# Altium project IceZUM_Core_HX1K.PrjPcb (part 1 of 2)
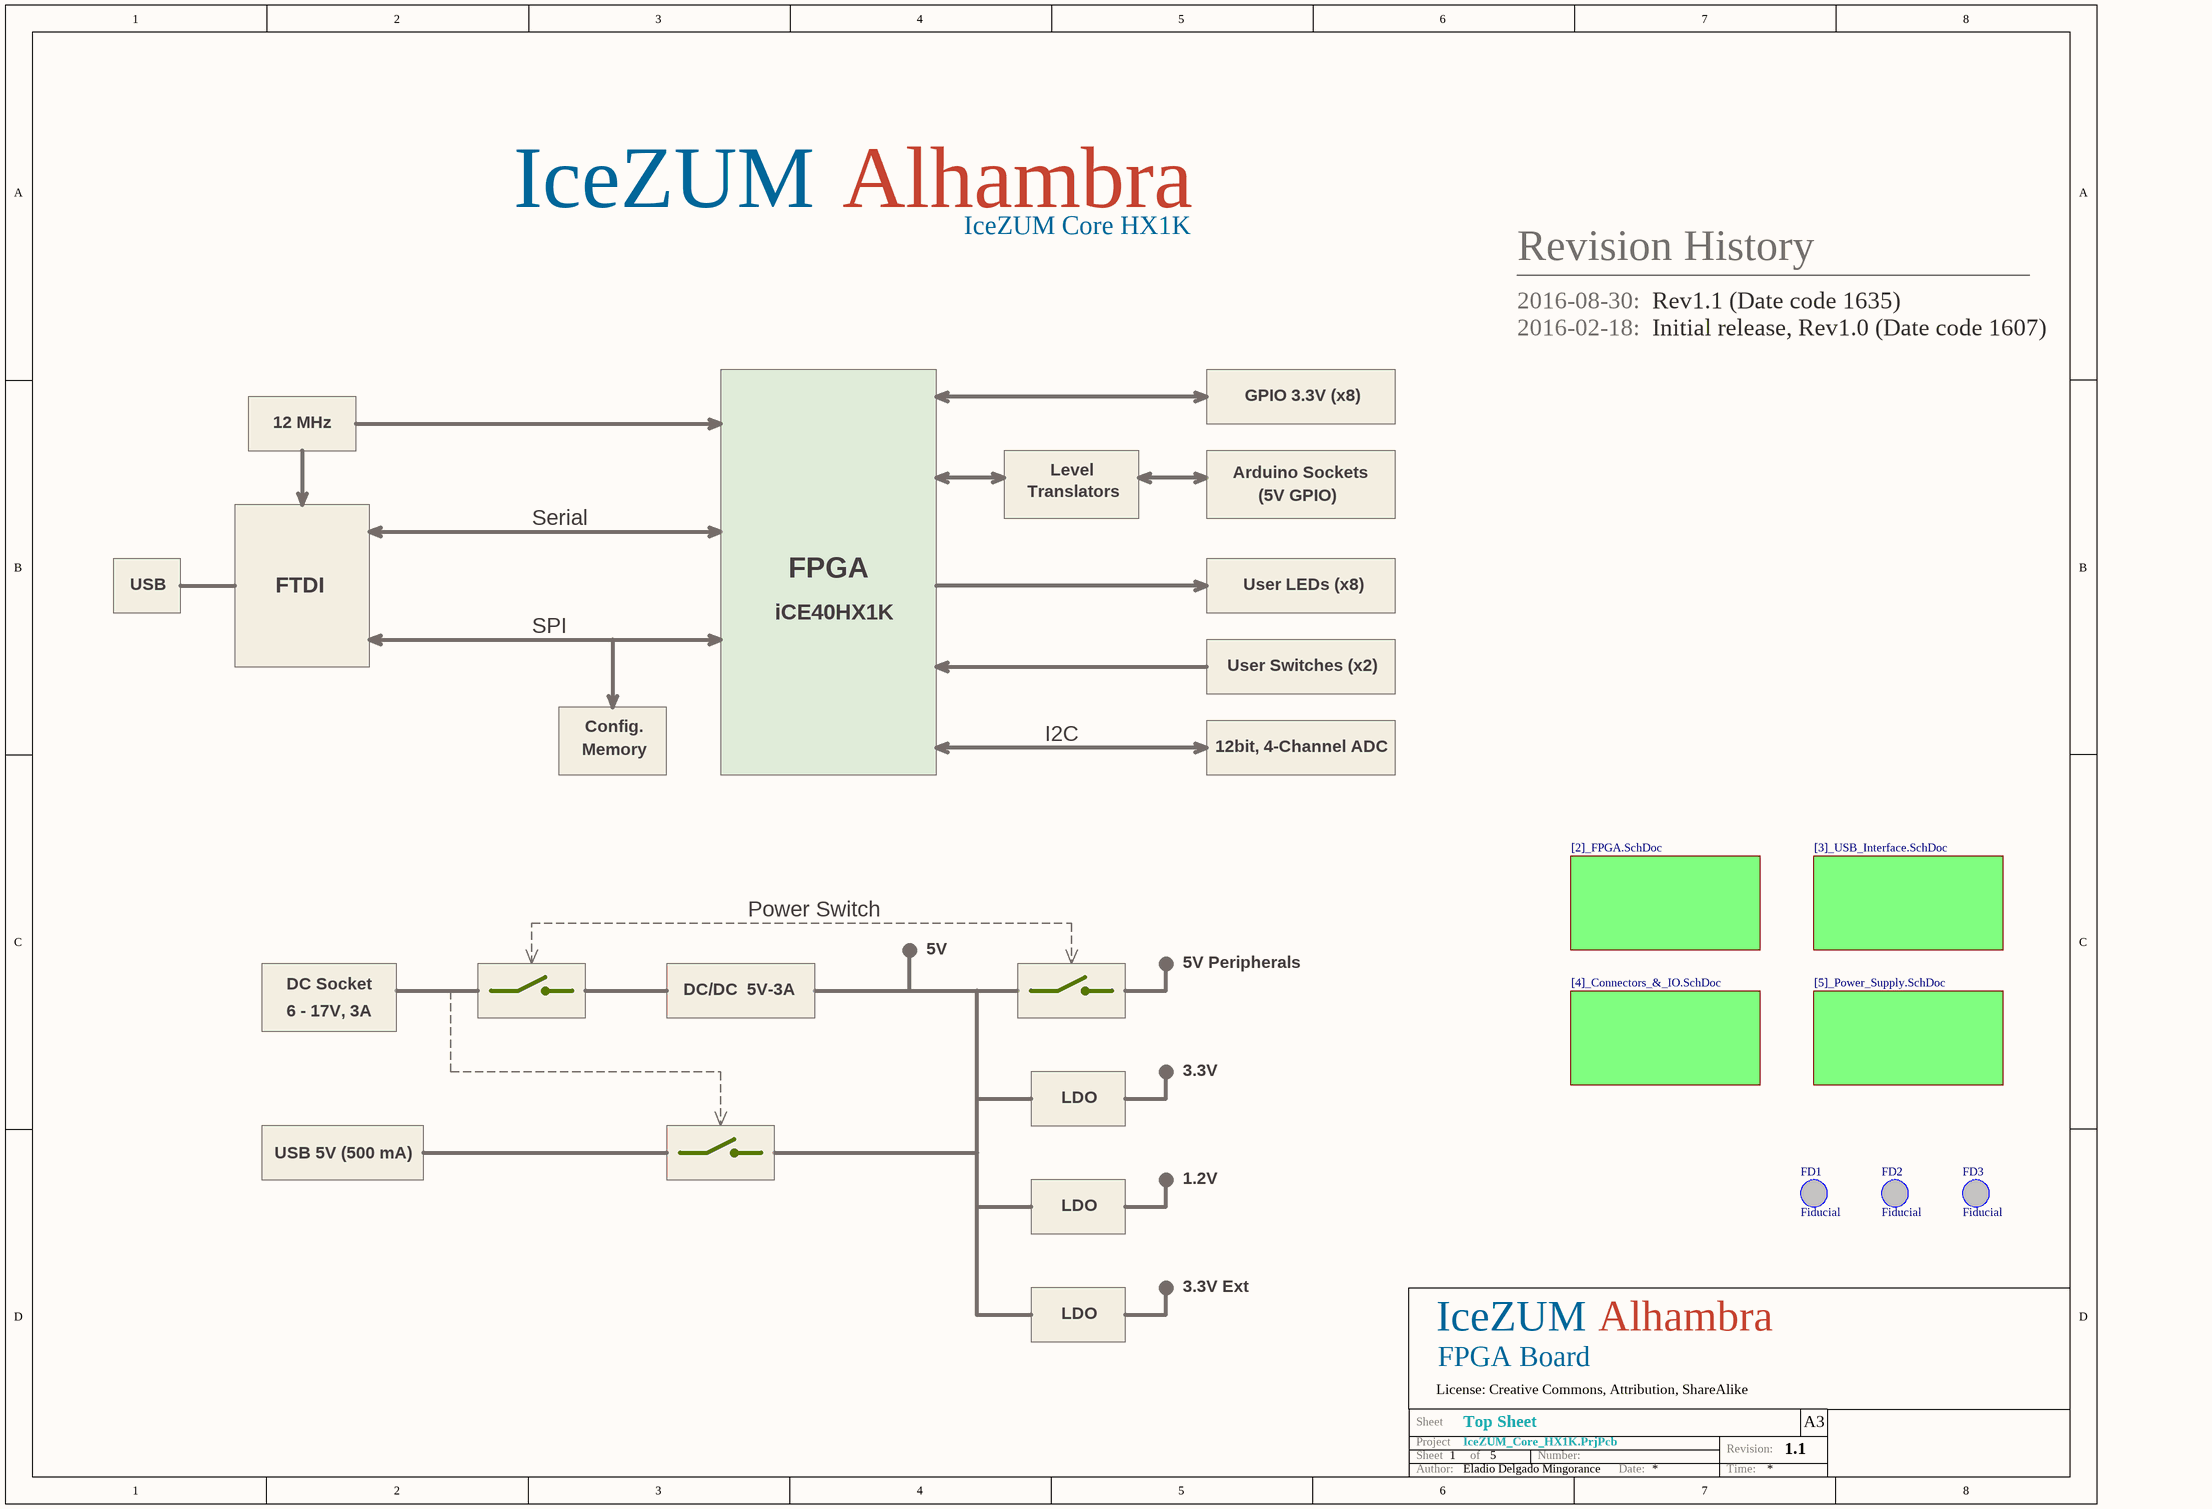
[diagram p0: [1]_IceZUM_Core_HX1K.SchDoc]
5 sheets, 189 parts. Net scope: flat (ports and power ports of the same name join across sheets).
Board file: IceZUM_Core_HX1K.PcbDoc
Sheets:
  [1]_IceZUM_Core_HX1K.SchDoc
    [2]_FPGA.SchDoc = [2]_FPGA.SchDoc
    [3]_USB_Interface.SchDoc = [3]_USB_Interface.SchDoc
    [4]_Connectors_&_IO.SchDoc = [4]_Connectors_&_IO.SchDoc
    [5]_Power_Supply.SchDoc = [5]_Power_Supply.SchDoc

## Sheet [1]_IceZUM_Core_HX1K.SchDoc: Top Sheet
size A3; Author: Eladio Delgado Mingorance; CompanyName: Mareldem Technologies; Organization: Mareldem Technologies; Revision: 1.1; SheetNumber: 1; SheetTotal: 5

### Parts
FD1  Fiducial  [Fiducial]  (no BOM)
FD2  Fiducial  [Fiducial]  (no BOM)
FD3  Fiducial  [Fiducial]  (no BOM)

### Sub-sheets
[2]_FPGA.SchDoc = [2]_FPGA.SchDoc: no entries
[3]_USB_Interface.SchDoc = [3]_USB_Interface.SchDoc: no entries
[4]_Connectors_&_IO.SchDoc = [4]_Connectors_&_IO.SchDoc: no entries
[5]_Power_Supply.SchDoc = [5]_Power_Supply.SchDoc: no entries

### Notes on the sheet
- IceZUM
- Alhambra
- IceZUM Core HX1K
- Revision History
- 2016-08-30:
- Rev1.1 (Date code 1635)
- 2016-02-18:
- Initial release, Rev1.0 (Date code 1607)
- 12 MHz
- GPIO 3.3V (x8)
- Translators
- Level
- Arduino Sockets
- (5V GPIO)
- Serial
- FPGA
- USB
- FTDI
- SPI
- iCE40HX1K
- User LEDs (x8)
- User Switches (x2)
- Memory
- Config.
- I2C
- 12bit, 4-Channel ADC
- Power Switch
- DC Socket
- 5V
- 5V Peripherals
- 6 - 17V, 3A
- DC/DC  5V-3A
- LDO
- 3.3V
- USB 5V (500 mA)
- 1.2V
- 3.3V Ext
- License: Creative Commons, Attribution, ShareAlike
- FPGA Board
- Project
- Sheet
- Sheet         of
- Number:
- Revision:
- A3
- Author:
- Date:
- Time:

### Library data of the parts
FD1-FD3 = Fiducial: Part Number: Fiducial

## Sheet [2]_FPGA.SchDoc: FPGA
size A3; Author: Eladio Delgado Mingorance; CompanyName: Mareldem Technologies; Organization: Mareldem Technologies; Revision: 1.1; SheetNumber: 2; SheetTotal: 5
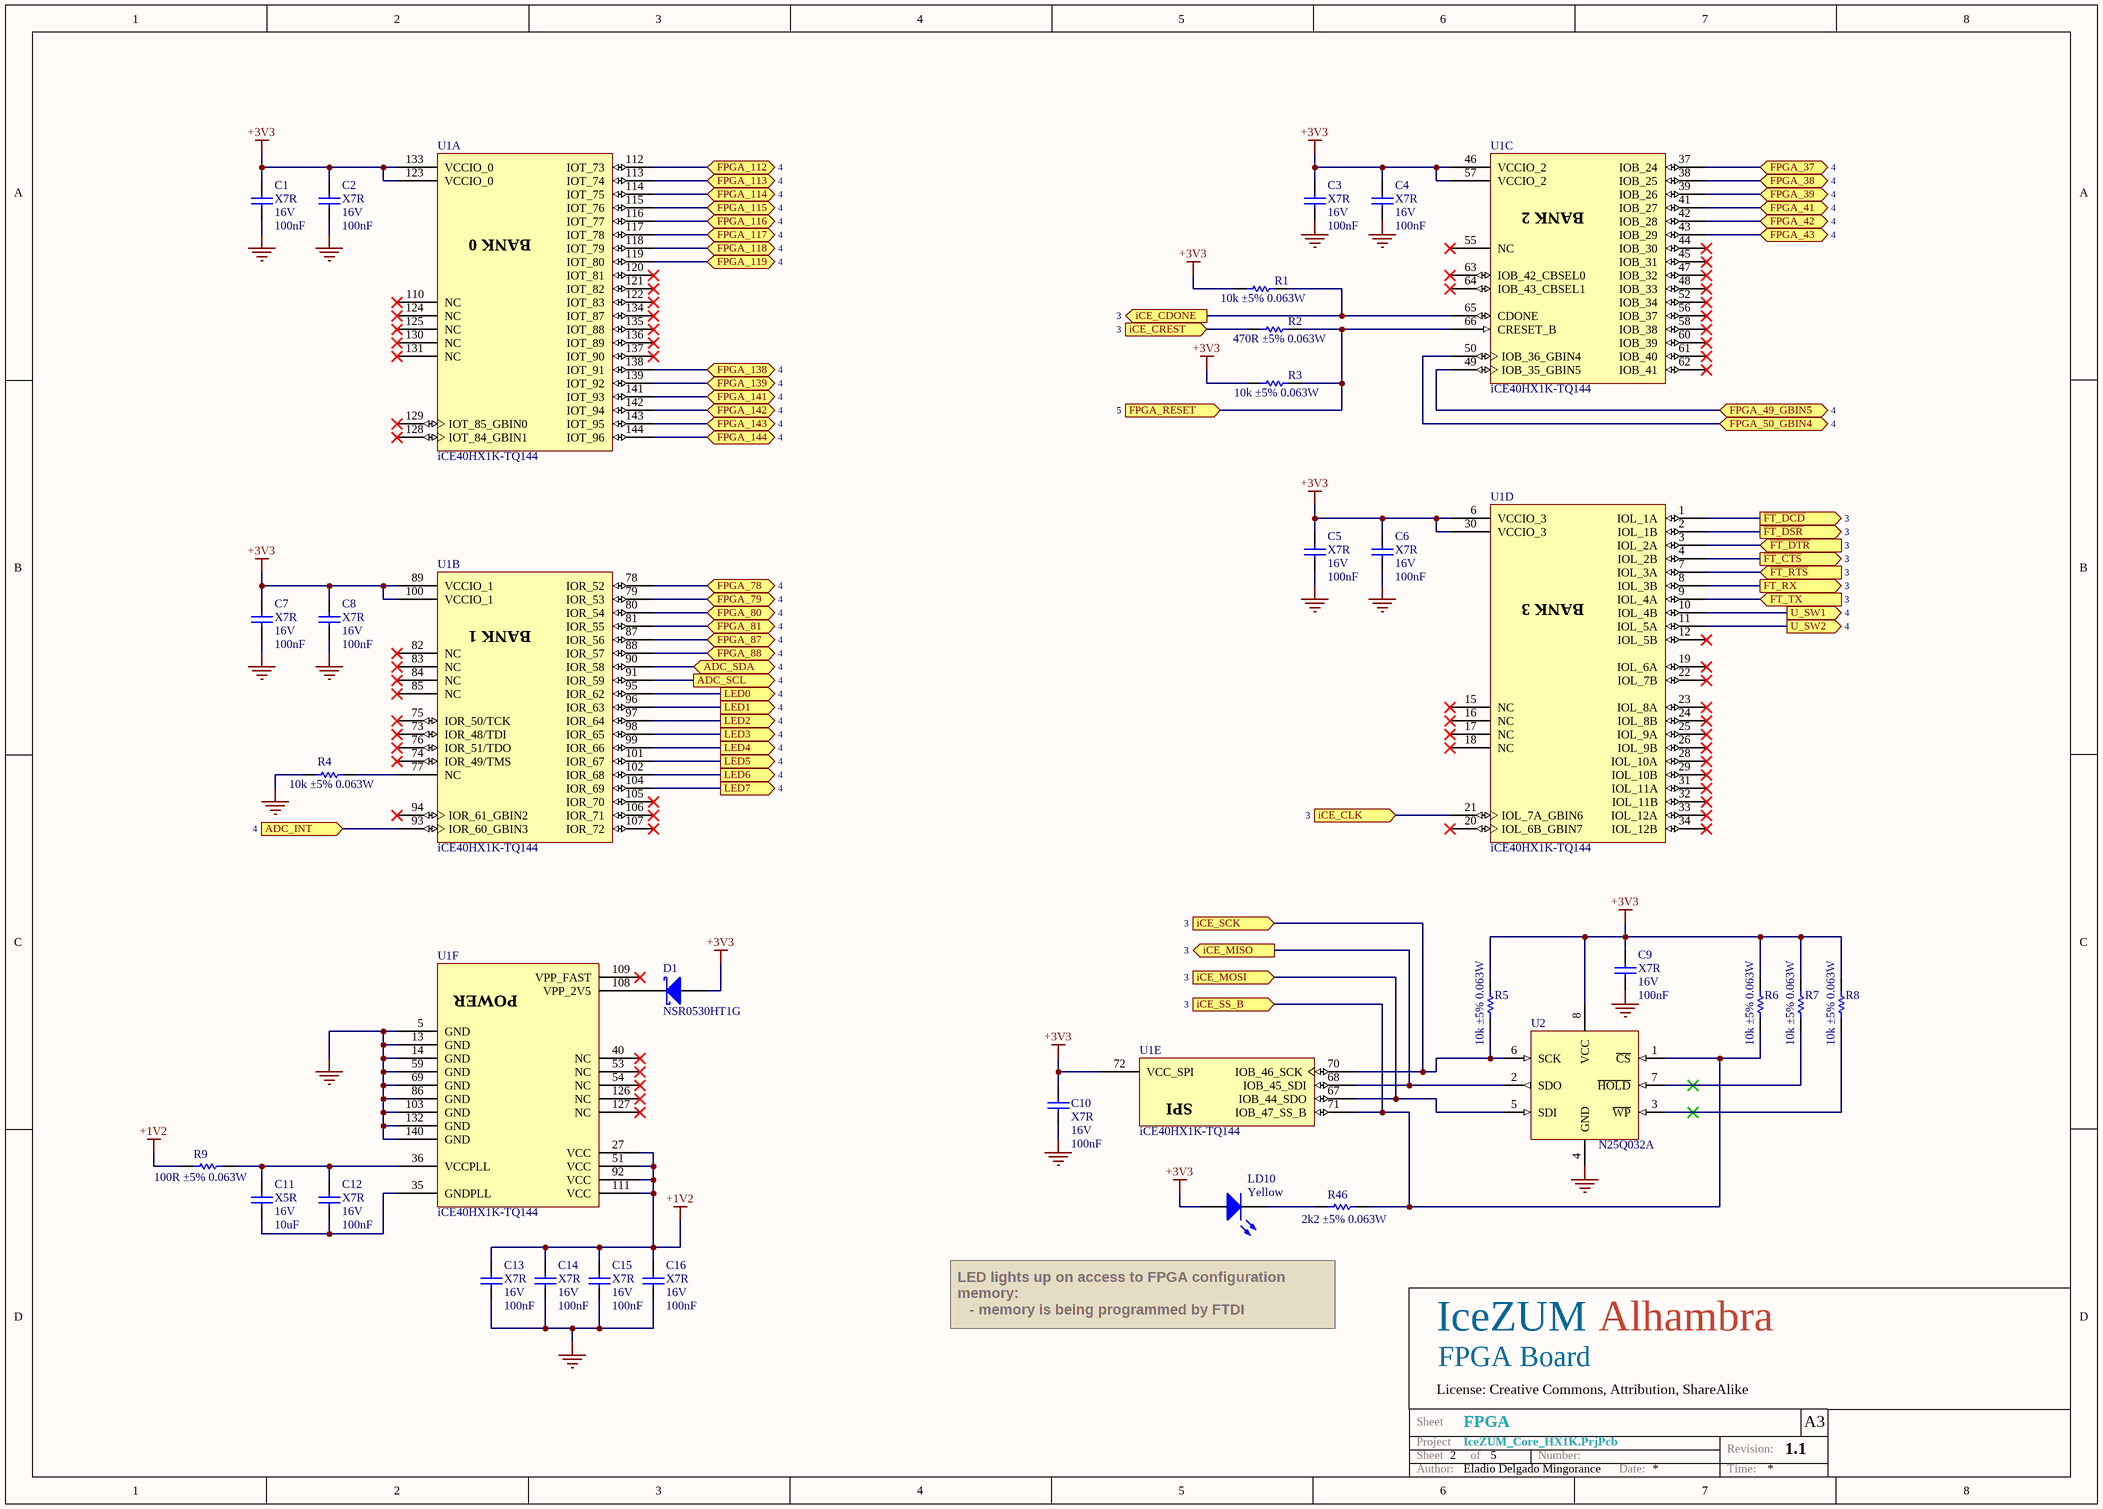
[diagram p1: [2]_FPGA.SchDoc]

### Parts
C1  Dielectric: X7R  Voltage: 16V  Capacitance: 100nF  [C0402]  (hidden comment: Capacitor)
C2  Dielectric: X7R  Voltage: 16V  Capacitance: 100nF  [C0402]  (hidden comment: Capacitor)
C3  Dielectric: X7R  Voltage: 16V  Capacitance: 100nF  [C0402]  (hidden comment: Capacitor)
C4  Dielectric: X7R  Voltage: 16V  Capacitance: 100nF  [C0402]  (hidden comment: Capacitor)
C5  Dielectric: X7R  Voltage: 16V  Capacitance: 100nF  [C0402]  (hidden comment: Capacitor)
C6  Dielectric: X7R  Voltage: 16V  Capacitance: 100nF  [C0402]  (hidden comment: Capacitor)
C7  Dielectric: X7R  Voltage: 16V  Capacitance: 100nF  [C0402]  (hidden comment: Capacitor)
C8  Dielectric: X7R  Voltage: 16V  Capacitance: 100nF  [C0402]  (hidden comment: Capacitor)
C9  Dielectric: X7R  Voltage: 16V  Capacitance: 100nF  [C0402]  (hidden comment: Capacitor)
C10  Dielectric: X7R  Voltage: 16V  Capacitance: 100nF  [C0402]  (hidden comment: Capacitor)
C11  Dielectric: X5R  Voltage: 16V  Capacitance: 10uF  [C0603]  (hidden comment: Capacitor)
C12  Dielectric: X7R  Voltage: 16V  Capacitance: 100nF  [C0402]  (hidden comment: Capacitor)
C13  Dielectric: X7R  Voltage: 16V  Capacitance: 100nF  [C0402]  (hidden comment: Capacitor)
C14  Dielectric: X7R  Voltage: 16V  Capacitance: 100nF  [C0402]  (hidden comment: Capacitor)
C15  Dielectric: X7R  Voltage: 16V  Capacitance: 100nF  [C0402]  (hidden comment: Capacitor)
C16  Dielectric: X7R  Voltage: 16V  Capacitance: 100nF  [C0402]  (hidden comment: Capacitor)
D1  NSR0530HT1G  [SOD323]
LD10  Yellow  [LED0603]
R1  value 10k ±5% 0.063W  [R0402]  (hidden comment: Resistor)
R2  value 470R ±5% 0.063W  [R0402]  (hidden comment: Resistor)
R3  value 10k ±5% 0.063W  [R0402]  (hidden comment: Resistor)
R4  value 10k ±5% 0.063W  [R0402]  (hidden comment: Resistor)
R5  value 10k ±5% 0.063W  [R0402]  (hidden comment: Resistor)
R6  value 10k ±5% 0.063W  [R0402]  (hidden comment: Resistor)
R7  value 10k ±5% 0.063W  [R0402]  (hidden comment: Resistor)
R8  value 10k ±5% 0.063W  [R0402]  (hidden comment: Resistor)
R9  value 100R ±5% 0.063W  [R0402]  (hidden comment: Resistor)
R46  value 2k2 ±5% 0.063W  [R0402]  (hidden comment: Resistor)
U1  iCE40HX1K-TQ144  [TQFP-144_IPC-MD_HX1K]  (parts A,B,C,D,E,F of 6)
U2  N25Q032A  [DFN-8 6x5mm]

### Ports
ADC_INT (in, see 4), ADC_SCL (out, see 4), ADC_SDA (bidir, see 4), FPGA_37 (bidir, see 4), FPGA_38 (bidir, see 4), FPGA_39 (bidir, see 4), FPGA_41 (bidir, see 4), FPGA_42 (bidir, see 4), FPGA_43 (bidir, see 4), FPGA_49_GBIN5 (bidir, see 4), FPGA_50_GBIN4 (bidir, see 4), FPGA_78 (bidir, see 4), FPGA_79 (bidir, see 4), FPGA_80 (bidir, see 4), FPGA_81 (bidir, see 4), FPGA_87 (bidir, see 4), FPGA_88 (bidir, see 4), FPGA_112 (bidir, see 4), FPGA_113 (bidir, see 4), FPGA_114 (bidir, see 4), FPGA_115 (bidir, see 4), FPGA_116 (bidir, see 4), FPGA_117 (bidir, see 4), FPGA_118 (bidir, see 4), FPGA_119 (bidir, see 4), FPGA_138 (bidir, see 4), FPGA_139 (bidir, see 4), FPGA_141 (bidir, see 4), FPGA_142 (bidir, see 4), FPGA_143 (bidir, see 4), FPGA_144 (bidir, see 4), FPGA_RESET (in, see 5), FT_RX (out, see 3), FT_TX (in, see 3), iCE_CDONE (out, see 3), iCE_CLK (in, see 3), iCE_CREST (in, see 3), iCE_MISO (out, see 3), iCE_MOSI (in, see 3), iCE_SCK (in, see 3), iCE_SS_B (in, see 3), LED0 (out, see 4), LED1 (out, see 4), LED2 (out, see 4), LED3 (out, see 4), LED4 (out, see 4), LED5 (out, see 4), LED6 (out, see 4), LED7 (out, see 4), U_SW1 (out, see 4), U_SW2 (out, see 4), ~{FT_CTS} (out, see 3), ~{FT_DCD} (out, see 3), ~{FT_DSR} (out, see 3), ~{FT_DTR} (in, see 3), ~{FT_RTS} (in, see 3)

### Nets
+1V2: C13.2 C14.2 C15.2 C16.2 R9.2 U1.27(VCC) U1.51(VCC) U1.92(VCC) U1.111(VCC)
+3V3: C1.2 C2.2 C3.2 C4.2 C5.2 C6.2 C7.2 C8.2 C9.1 C10.2 D1.A LD10.A R1.1 R3.1 R5.2 R6.2 R7.2 R8.2 U1.6(VCCIO_3) U1.30(VCCIO_3) U1.46(VCCIO_2) U1.57(VCCIO_2) U1.72(VCC_SPI) U1.89(VCCIO_1) U1.100(VCCIO_1) U1.123(VCCIO_0) U1.133(VCCIO_0) U2.8(VCC)
GND: C1.1 C2.1 C3.1 C4.1 C5.1 C6.1 C7.1 C8.1 C9.2 C10.1 C13.1 C14.1 C15.1 C16.1 R4.1 U1.5(GND) U1.13(GND) U1.14(GND) U1.59(GND) U1.69(GND) U1.86(GND) U1.103(GND) U1.132(GND) U1.140(GND) U2.4(GND)
GPIO_L0: R6.1 R46.2 U1.71(IOB_47_SS_B) U2.1(~{CS}) ; port iCE_SS_B
GPIO_L2: R1.2 U1.65(CDONE) ; port iCE_CDONE
GPIO_L3: R2.1 ; port iCE_CREST
SPI_DI: U1.68(IOB_45_SDI) U2.2(SDO) ; port iCE_MISO
SPI_DO: U1.67(IOB_44_SDO) U2.5(SDI) ; port iCE_MOSI
SPI_SK: R5.1 U1.70(IOB_46_SCK) U2.6(SCK) ; port iCE_SCK
NetC11_1: C11.1 C12.1 U1.35(GNDPLL)
NetC11_2: C11.2 C12.2 R9.1 U1.36(VCCPLL)
NetC34_2: U1.10(IOL_4B) ; port U_SW1
NetC35_2: U1.11(IOL_5A) ; port U_SW2
NetD1_k: D1.k(K) U1.108(VPP_2V5)
NetD4_A: R2.2 R3.2 U1.66(CRESET_B) ; port FPGA_RESET
NetJ19_1: U1.37(IOB_24) ; port FPGA_37
NetJ19_2: U1.38(IOB_25) ; port FPGA_38
NetJ19_3: U1.39(IOB_26) ; port FPGA_39
NetJ19_4: U1.41(IOB_27) ; port FPGA_41
NetJ19_5: U1.42(IOB_28) ; port FPGA_42
NetJ19_6: U1.43(IOB_29) ; port FPGA_43
NetJ19_7: U1.49(IOB_35_GBIN5) ; port FPGA_49_GBIN5
NetJ19_8: U1.50(IOB_36_GBIN4) ; port FPGA_50_GBIN4
NetLD10_K: LD10.K R46.1
NetR4_2: R4.2 U1.77(NC)
NetR7_1: R7.1 U2.7(~{HOLD})
NetR8_1: R8.1 U2.3(~{WP})
NetR16_2: U1.21(IOL_7A_GBIN6) ; port iCE_CLK
NetR17_1: U1.95(IOR_62) ; port LED0
NetR18_1: U1.96(IOR_63) ; port LED1
NetR20_1: U1.91(IOR_59) ; port ADC_SCL
NetR21_1: U1.90(IOR_58) ; port ADC_SDA
NetR40_1: U1.97(IOR_64) ; port LED2
NetR41_1: U1.98(IOR_65) ; port LED3
NetR42_1: U1.99(IOR_66) ; port LED4
NetR43_1: U1.101(IOR_67) ; port LED5
NetR44_1: U1.102(IOR_68) ; port LED6
NetR45_1: U1.104(IOR_69) ; port LED7
NetU1_1: U1.1(IOL_1A) ; port ~{FT_DCD}
NetU1_2: U1.2(IOL_1B) ; port ~{FT_DSR}
NetU1_3: U1.3(IOL_2A) ; port ~{FT_DTR}
NetU1_4: U1.4(IOL_2B) ; port ~{FT_CTS}
NetU1_7: U1.7(IOL_3A) ; port ~{FT_RTS}
NetU1_8: U1.8(IOL_3B) ; port FT_RX
NetU1_9: U1.9(IOL_4A) ; port FT_TX
NetU1_78: U1.78(IOR_52) ; port FPGA_78
NetU1_79: U1.79(IOR_53) ; port FPGA_79
NetU1_80: U1.80(IOR_54) ; port FPGA_80
NetU1_81: U1.81(IOR_55) ; port FPGA_81
NetU1_87: U1.87(IOR_56) ; port FPGA_87
NetU1_88: U1.88(IOR_57) ; port FPGA_88
NetU1_93: U1.93(IOR_60_GBIN3) ; port ADC_INT
NetU1_112: U1.112(IOT_73) ; port FPGA_112
NetU1_113: U1.113(IOT_74) ; port FPGA_113
NetU1_114: U1.114(IOT_75) ; port FPGA_114
NetU1_115: U1.115(IOT_76) ; port FPGA_115
NetU1_116: U1.116(IOT_77) ; port FPGA_116
NetU1_117: U1.117(IOT_78) ; port FPGA_117
NetU1_118: U1.118(IOT_79) ; port FPGA_118
NetU1_119: U1.119(IOT_80) ; port FPGA_119
NetU1_138: U1.138(IOT_91) ; port FPGA_138
NetU1_139: U1.139(IOT_92) ; port FPGA_139
NetU1_141: U1.141(IOT_93) ; port FPGA_141
NetU1_142: U1.142(IOT_94) ; port FPGA_142
NetU1_143: U1.143(IOT_95) ; port FPGA_143
NetU1_144: U1.144(IOT_96) ; port FPGA_144

Not connected (* = marked no-connect by the designer): U1 12(IOL_5B)* 15(NC)* 16(NC)* 17(NC)* 18(NC)* 19(IOL_6A)* 20(IOL_6B_GBIN7)* 22(IOL_7B)* 23(IOL_8A)* 24(IOL_8B)* 25(IOL_9A)* 26(IOL_9B)* 28(IOL_10A)* 29(IOL_10B)* 31(IOL_11A)* 32(IOL_11B)* 33(IOL_12A)* 34(IOL_12B)* 40(NC)* 44(IOB_30)* 45(IOB_31)* 47(IOB_32)* 48(IOB_33)* 52(IOB_34)* 53(NC)* 54(NC)* 55(NC)* 56(IOB_37)* 58(IOB_38)* 60(IOB_39)* 61(IOB_40)* 62(IOB_41)* 63(IOB_42_CBSEL0)* 64(IOB_43_CBSEL1)* 73(IOR_48/TDI)* 74(IOR_49/TMS)* 75(IOR_50/TCK)* 76(IOR_51/TDO)* 82(NC)* 83(NC)* 84(NC)* 85(NC)* 94(IOR_61_GBIN2)* 105(IOR_70)* 106(IOR_71)* 107(IOR_72)* 109(VPP_FAST)* 110(NC)* 120(IOT_81)* 121(IOT_82)* 122(IOT_83)* 124(NC)* 125(NC)* 126(NC)* 127(NC)* 128(IOT_84_GBIN1)* 129(IOT_85_GBIN0)* 130(NC)* 131(NC)* 134(IOT_87)* 135(IOT_88)* 136(IOT_89)* 137(IOT_90)*

### Notes on the sheet
- LED lights up on access to FPGA configuration memory:
  - memory is being programmed by FTDI
  - memory is being read by FPGA after reset or power-on
- License: Creative Commons, Attribution, ShareAlike
- IceZUM
- FPGA Board
- Alhambra
- Project
- Sheet
- Sheet         of
- Number:
- Revision:
- A3
- Author:
- Date:
- Time:
- (in symbol iCE40-HX1K, part A) BANK 0
- (in symbol iCE40-HX1K, part B) BANK 1
- (in symbol iCE40-HX1K, part C) BANK 2
- (in symbol iCE40-HX1K, part D) BANK 3
- (in symbol iCE40-HX1K, part E) SPI
- (in symbol iCE40-HX1K, part F) POWER

### Library data of the parts
C1-C10 C12-C16 = C0402_100nF_16V_±10%: Capacitor SMD; Manufacturer: Kemet; Value: 100nF ±10% 16V; Tolerance: ±10%; OrderingCode: C0402C104K4RAC; Temp_ Max: 125; Temp_ Min: -55; Part Number: C0402_100nF_16V_±10%; Price (€): 0,05
C11 = C0603_10uF_16V_±20%: Capacitor SMD; Manufacturer: Taiyo Yuden; Value: 10uF ±20% 16V; Tolerance: ±20%; OrderingCode: EMK107BBJ106MA-T; Temp_ Max: 85; Temp_ Min: -55; OrderingCode 2: C1608X5R1C106M080AB; Part Number: C0603_10uF_16V_±20%; Price (€): 0,124; Manufacturer 2: TDK
D1 = NSR0530HT1G: Schottky Diode; Manufacturer: On Semiconductor; Ifor: 500mA; Vrrm: 30V; Vf: 0,37V; Temp_ Max: 150; Temp_ Min: -55; Value: 500mA 30V; Part Number: NSR0530HT1G; Ifsm: 500mA; OrderingCode: NSR0530HT1G; Price (€): 0,031
LD10 = LED Yellow 0603: LED; Manufacturer: KINGBRIGHT; OrderingCode: APT1608SYCK; Temp_ Max: 85; Temp_ Min: -40; Part Number: LED Yellow 0603; Price (€): 0,06; Value: Yellow
R1 R3-R8 = R0402_10k_0.063W_±5%: Resistor, SMD; Manufacturer: Vishay; Tolerance: ±5%; OrderingCode: CRCW040210K0JN; Power: 0.063W; Resistance: 10k; Temp_ Max: 155; Temp_ Min: -55; PackageDescription: SMD; Part Number: R0402_10k_0.063W_±5%; Price (€): 0,003
R2 = R0402_470R_0.063W_±5%: Resistor, SMD; Manufacturer: Vishay; Tolerance: ±5%; OrderingCode: CRCW0402470RJN; Power: 0.063W; Resistance: 470R; Temp_ Max: 155; Temp_ Min: -55; PackageDescription: SMD; Part Number: R0402_470R_0.063W_±5%; Price (€): 0,003
R9 = R0402_100R_0.063W_±5%: Resistor, SMD; Manufacturer: Vishay; Tolerance: ±5%; OrderingCode: CRCW0402100RJN; Power: 0.063W; Resistance: 100R; Temp_ Max: 155; Temp_ Min: -55; PackageDescription: SMD; Part Number: R0402_100R_0.063W_±5%; Price (€): 0,003
R46 = R0402_2k2_0.063W_±5%: Resistor, SMD; Manufacturer: Vishay; Tolerance: ±5%; OrderingCode: CRCW04022K20JN; Power: 0.063W; Resistance: 2k2; Temp_ Max: 155; Temp_ Min: -55; PackageDescription: SMD; Part Number: R0402_2k2_0.063W_±5%; Price (€): 0,003
U1 = iCE40-HX1K: iCE40 HX1K Series FPGA Family, 1280 Logic Cells, 1.2 V Core, 64 K Embedded RAM Bits, 144-pin TQFP, Pb-Free, Tray; Manufacturer: Lattice; Temp_ Max: 85; Temp_ Min: -40; Part Number: iCE40-HX1K; OrderingCode: iCE40HX1K-TQ144; Price (€): 4
U2 = N25Q032A: NOR Flash Memory, serial; Manufacturer: Micron; OrderingCode: N25Q032A13EF640E; Temp_ Max: 85; Temp_ Min: -40; OrderingCode 2: S25FL032P0XNFI011; Value: 32Mb; Part Number: N25Q032A; Supplier: Silica; Price (€): 0,9; Manufacturer 2: Spansion

## Sheet [3]_USB_Interface.SchDoc: USB
size A3; Author: Eladio Delgado Mingorance; CompanyName: Mareldem Technologies; Organization: Mareldem Technologies; Revision: 1.1; SheetNumber: 3; SheetTotal: 5
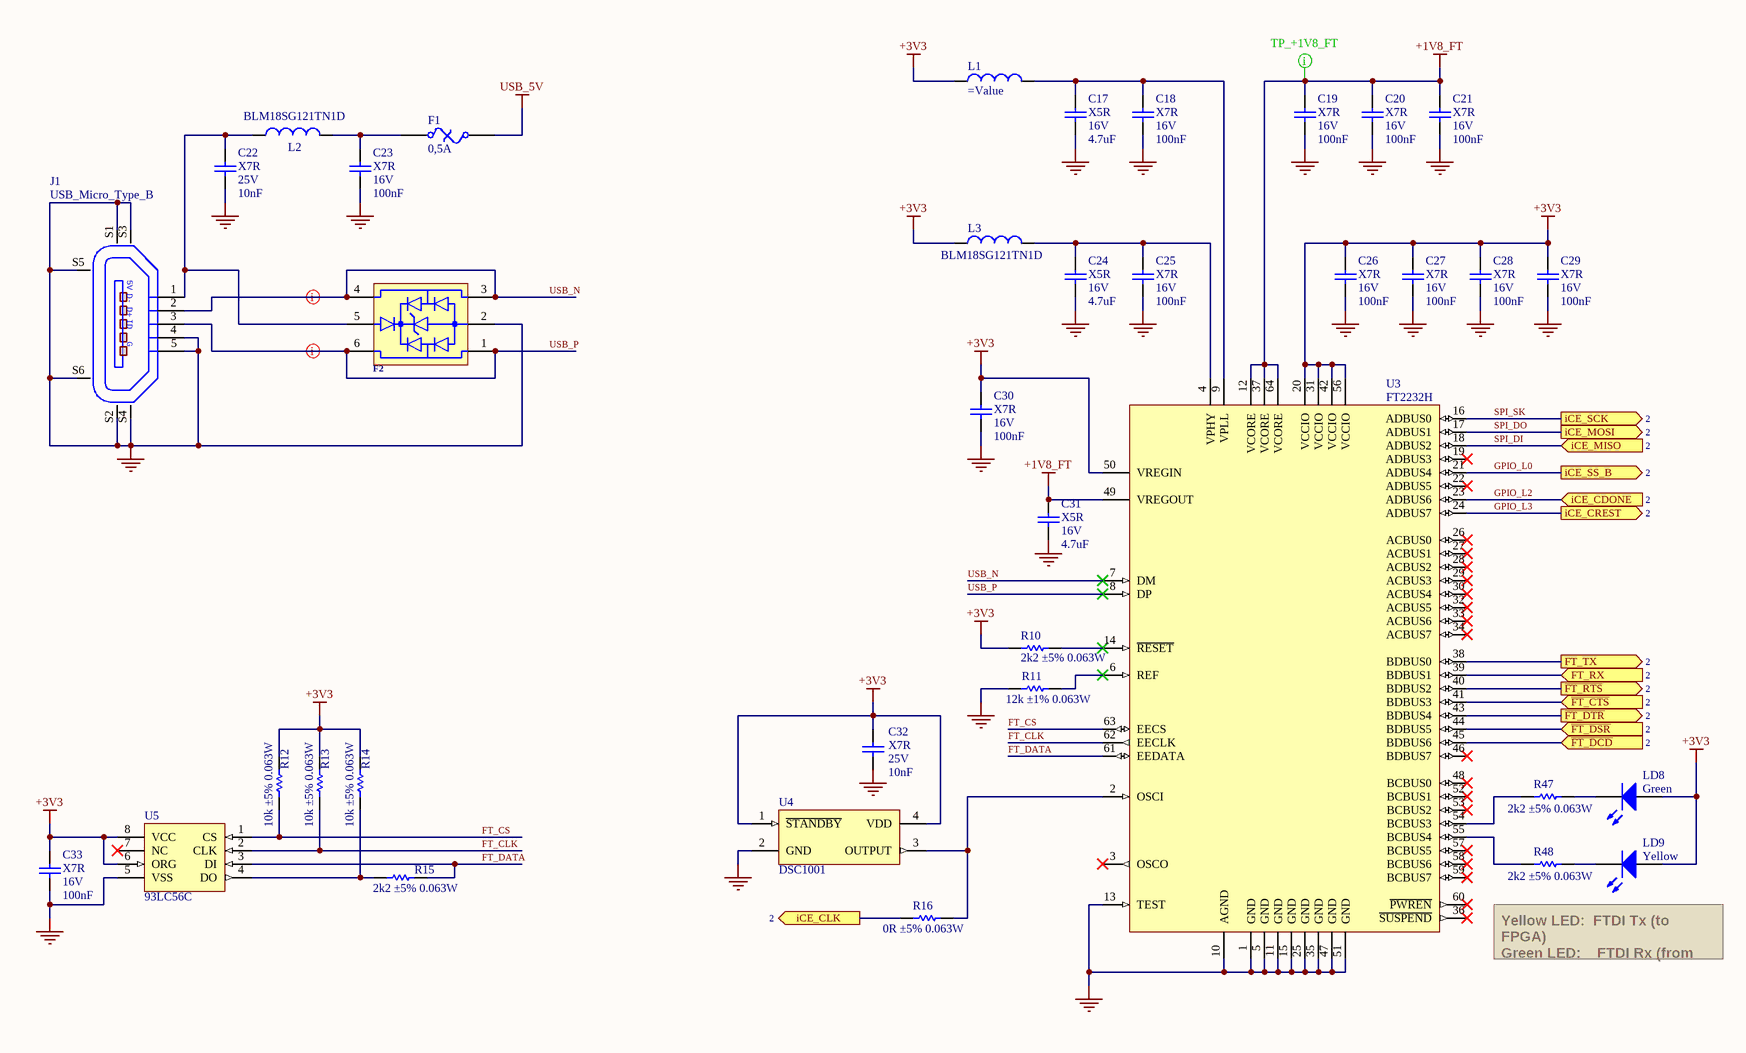
[diagram p2: [3]_USB_Interface.SchDoc]

### Parts
C17  Dielectric: X5R  Voltage: 16V  Capacitance: 4.7uF  [C0603]  (hidden comment: Capacitor)
C18  Dielectric: X7R  Voltage: 16V  Capacitance: 100nF  [C0402]  (hidden comment: Capacitor)
C19  Dielectric: X7R  Voltage: 16V  Capacitance: 100nF  [C0402]  (hidden comment: Capacitor)
C20  Dielectric: X7R  Voltage: 16V  Capacitance: 100nF  [C0402]  (hidden comment: Capacitor)
C21  Dielectric: X7R  Voltage: 16V  Capacitance: 100nF  [C0402]  (hidden comment: Capacitor)
C22  Dielectric: X7R  Voltage: 25V  Capacitance: 10nF  [C0603]  (hidden comment: Capacitor)
C23  Dielectric: X7R  Voltage: 16V  Capacitance: 100nF  [C0402]  (hidden comment: Capacitor)
C24  Dielectric: X5R  Voltage: 16V  Capacitance: 4.7uF  [C0603]  (hidden comment: Capacitor)
C25  Dielectric: X7R  Voltage: 16V  Capacitance: 100nF  [C0402]  (hidden comment: Capacitor)
C26  Dielectric: X7R  Voltage: 16V  Capacitance: 100nF  [C0402]  (hidden comment: Capacitor)
C27  Dielectric: X7R  Voltage: 16V  Capacitance: 100nF  [C0402]  (hidden comment: Capacitor)
C28  Dielectric: X7R  Voltage: 16V  Capacitance: 100nF  [C0402]  (hidden comment: Capacitor)
C29  Dielectric: X7R  Voltage: 16V  Capacitance: 100nF  [C0402]  (hidden comment: Capacitor)
C30  Dielectric: X7R  Voltage: 16V  Capacitance: 100nF  [C0402]  (hidden comment: Capacitor)
C31  Dielectric: X5R  Voltage: 16V  Capacitance: 4.7uF  [C0603]  (hidden comment: Capacitor)
C32  Dielectric: X7R  Voltage: 25V  Capacitance: 10nF  [C0603]  (hidden comment: Capacitor)
C33  Dielectric: X7R  Voltage: 16V  Capacitance: 100nF  [C0402]  (hidden comment: Capacitor)
F1  0,5A  [F0805]
F2  ESDUSB  [SOT563]  (value not drawn)
J1  USB_Micro_Type_B  [USB_Micro_B]
L1  (no value)  [L0805]
L2  BLM18SG121TN1D  [L0603]
L3  BLM18SG121TN1D  [L0603]
LD8  Green  [LED0603]
LD9  Yellow  [LED0603]
R10  value 2k2 ±5% 0.063W  [R0402]  (hidden comment: Resistor)
R11  value 12k ±1% 0.063W  [R0402]  (hidden comment: Resistor)
R12  value 10k ±5% 0.063W  [R0402]  (hidden comment: Resistor)
R13  value 10k ±5% 0.063W  [R0402]  (hidden comment: Resistor)
R14  value 10k ±5% 0.063W  [R0402]  (hidden comment: Resistor)
R15  value 2k2 ±5% 0.063W  [R0402]  (hidden comment: Resistor)
R16  value 0R ±5% 0.063W  [R0402]  (hidden comment: Resistor)
R47  value 2k2 ±5% 0.063W  [R0402]  (hidden comment: Resistor)
R48  value 2k2 ±5% 0.063W  [R0402]  (hidden comment: Resistor)
U3  FT2232H  [FTDI_QFN-64]
U4  DSC1001  [OSC 3.2x2.5]
U5  93LC56C  [MSOP8]

### Ports
FT_RX (in, see 2), FT_TX (out, see 2), iCE_CDONE (in, see 2), iCE_CLK (out, see 2), iCE_CREST (out, see 2), iCE_MISO (in, see 2), iCE_MOSI (out, see 2), iCE_SCK (out, see 2), iCE_SS_B (out, see 2), ~{FT_CTS} (in, see 2), ~{FT_DCD} (in, see 2), ~{FT_DSR} (in, see 2), ~{FT_DTR} (out, see 2), ~{FT_RTS} (out, see 2)

### Nets
+1V8_FT: C19.2 C20.2 C21.2 C31.2 U3.12(VCORE) U3.37(VCORE) U3.49(VREGOUT) U3.64(VCORE)
+3V3: C26.2 C27.2 C28.2 C29.2 C30.2 C32.2 C33.2 L1.1 L3.1 LD8.A LD9.A R10.2 R12.2 R13.2 R14.2 U3.20(VCCIO) U3.31(VCCIO) U3.42(VCCIO) U3.50(VREGIN) U3.56(VCCIO) U4.1(~{STANDBY}) U4.4(VDD) U5.6(ORG) U5.8(VCC)
GND: C17.1 C18.1 C19.1 C20.1 C21.1 C22.1 C23.1 C24.1 C25.1 C26.1 C27.1 C28.1 C29.1 C30.1 C31.1 C32.1 C33.1 F2.2 J1.4(P4) J1.5(P5) J1.S1(SHLD1) J1.S2(SHLD2) J1.S3(SHLD3) J1.S4(SHLD4) J1.S5(SHLD5) J1.S6(SHLD6) R11.2 U3.1(GND) U3.5(GND) U3.10(AGND) U3.11(GND) U3.13(TEST) U3.15(GND) U3.25(GND) U3.35(GND) U3.47(GND) U3.51(GND) U4.2(GND) U5.5(VSS)
USB_5V: F1.2
FT_CLK: R13.1 U3.62(EECLK) U5.2(CLK)
FT_CS: R12.1 U3.63(EECS) U5.1(CS)
FT_DATA: R15.1 U3.61(EEDATA) U5.3(DI)
GPIO_L0: U3.21(ADBUS4) ; port iCE_SS_B
GPIO_L2: U3.23(ADBUS6) ; port iCE_CDONE
GPIO_L3: U3.24(ADBUS7) ; port iCE_CREST
SPI_DI: U3.18(ADBUS2) ; port iCE_MISO
SPI_DO: U3.17(ADBUS1) ; port iCE_MOSI
SPI_SK: U3.16(ADBUS0) ; port iCE_SCK
USB_N: F2.3 F2.4 J1.2(P2) U3.7(DM)
USB_P: F2.1 F2.6 J1.3(P3) U3.8(DP)
NetC17_2: C17.2 C18.2 L1.2 U3.9(VPLL)
NetC22_2: C22.2 F2.5 J1.1(P1) L2.1
NetC23_2: C23.2 F1.1 L2.2
NetC24_2: C24.2 C25.2 L3.2 U3.4(VPHY)
NetLD8_K: LD8.K R47.2
NetLD9_K: LD9.K R48.2
NetR10_1: R10.1 U3.14(~{RESET})
NetR11_1: R11.1 U3.6(REF)
NetR14_1: R14.1 R15.2 U5.4(DO)
NetR16_1: R16.1 U3.2(OSCI) U4.3(OUTPUT)
NetR16_2: R16.2 ; port iCE_CLK
NetR47_1: R47.1 U3.54(BCBUS3)
NetR48_1: R48.1 U3.55(BCBUS4)
NetU1_1: U3.45(BDBUS6) ; port ~{FT_DCD}
NetU1_2: U3.44(BDBUS5) ; port ~{FT_DSR}
NetU1_3: U3.43(BDBUS4) ; port ~{FT_DTR}
NetU1_4: U3.41(BDBUS3) ; port ~{FT_CTS}
NetU1_7: U3.40(BDBUS2) ; port ~{FT_RTS}
NetU1_8: U3.39(BDBUS1) ; port FT_RX
NetU1_9: U3.38(BDBUS0) ; port FT_TX

Not connected (* = marked no-connect by the designer): U3 3(OSCO)* 19(ADBUS3)* 22(ADBUS5)* 26(ACBUS0)* 27(ACBUS1)* 28(ACBUS2)* 29(ACBUS3)* 30(ACBUS4)* 32(ACBUS5)* 33(ACBUS6)* 34(ACBUS7)* 36(~{SUSPEND})* 46(BDBUS7)* 48(BCBUS0)* 52(BCBUS1)* 53(BCBUS2)* 57(BCBUS5)* 58(BCBUS6)* 59(BCBUS7)* 60(~{PWREN})*; U5 7(NC)*

### Layout directives
differential pair: USB_N, USB_P
net class Test Points: +1V8_FT

### Notes on the sheet
- Yellow LED:  FTDI Tx (to FPGA)
  Green LED:    FTDI Rx (from FPGA)
- License: Creative Commons, Attribution, ShareAlike
- IceZUM
- FPGA Board
- Alhambra
- Project
- Sheet
- Sheet         of
- Number:
- Revision:
- A3
- Author:
- Date:
- Time:
- (in symbol Micro USB Type B SMD) 5V; D-; D+; ID; G

### Library data of the parts
C17 C24 C31 = C0603_4.7uF_16V_±10%: Capacitor SMD; Manufacturer: TDK; Value: 4.7uF ±10% 16V; Tolerance: ±10%; OrderingCode: C1608X5R1C475K080AC; Temp_ Max: 85; Temp_ Min: -55; Part Number: C0603_4.7uF_16V_±10%; Price (€): 0,068
C18-C21 C23 C25-C30 C33 = C0402_100nF_16V_±10%: as C1 on sheet [2]_FPGA; Part Number: C0402_100nF_16V_±10%; Price (€): 0,05
C22 = C0603_10nF_25V_±10%: Manufacturer: Kemet; Value: 10nF ±10% 25V; Tolerance: ±10%; OrderingCode: C0603C103K3RAC; Temp_ Max: 125; Temp_ Min: -55; Part Number: C0603_10nF_25V_±10%; Price (€): 0,035
C32 = C0603_10nF_25V_±10%: Capacitor SMD; Manufacturer: Kemet; Value: 10nF ±10% 25V; Tolerance: ±10%; OrderingCode: C0603C103K3RAC; Temp_ Max: 125; Temp_ Min: -55; Part Number: C0603_10nF_25V_±10%; Price (€): 0,035
F1 = PTC Fuse 0.5A 6V 0805: Protection, PTC Resettable Fuse; Manufacturer: Bourns; Voltage: 6V; OrderingCode: MF-PSMF050X-2; Temp_ Max: 85; Temp_ Min: -40; Part Number: PTC Fuse 0.5A 6V 0805; Current: 0,5A; Price (€): 0,17
F2 = USB ESD Single: Protection, USB ESD; Manufacturer: Würth; OrderingCode: 82400152; Temp_ Max: 125; Temp_ Min: -40; OrderingCode 2: CDSOT563-0502; Part Number: USB ESD Single; Supplier: Würth; Price (€): 0,1; Manufacturer 2: Bourns
J1 = Micro USB Type B SMD: Connector, USB Micro B; Manufacturer: FCI; OrderingCode: 10118192-0001LF; Temp_ Max: 85; Temp_ Min: -30; OrderingCode 2: ZX62-B-5PA-11; Part Number: Micro USB Type B SMD; Supplier: Abacus; Price (€): 0,11; Manufacturer 2: Hirose Connector
L1 = 10uH_0,1A: Inductor SMD; Manufacturer: muRata; L: 10uH; Rdc: 0,60R; Current: 0,1A; OrderingCode: LQM21FN100M70L; Temp_ Max: 125; Temp_ Min: -55; Value: 10uH 0,1A; Part Number: 10uH_0,1A; Price (€): 0,062
L2 = L0603_120R_0,025R_3000mA: Manufacturer: Murata; Resistance_100MHz: 120R; Resistance_DC: 0,025R; Current: 3000mA; Temp_ Max: 125; Temp_ Min: -55; Value: 120R 0,025R 3000mA; Part Number: L0603_120R_0,025R_3000mA; OrderingCode: BLM18SG121TN1D; Price (€): 0,053
L3 = L0603_120R_0,025R_3000mA: Ferrite Bead; Manufacturer: Murata; Resistance_100MHz: 120R; Resistance_DC: 0,025R; Current: 3000mA; Temp_ Max: 125; Temp_ Min: -55; Value: 120R 0,025R 3000mA; Part Number: L0603_120R_0,025R_3000mA; OrderingCode: BLM18SG121TN1D; Price (€): 0,053
LD8 = LED Green 0603: LED; Manufacturer: OSRAM Opto; OrderingCode: LG Q396-PS-35; Temp_ Max: 85; Temp_ Min: -30; Part Number: LED Green 0603; Price (€): 0,058; Value: Green
LD9 = LED Yellow 0603: as LD10 on sheet [2]_FPGA; Part Number: LED Yellow 0603; Price (€): 0,06; Value: Yellow
R10 R15 R47 R48 = R0402_2k2_0.063W_±5%: as R46 on sheet [2]_FPGA; PackageDescription: SMD; Part Number: R0402_2k2_0.063W_±5%; Price (€): 0,003
R11 = R0402_12k_0.063W_±1%: Resistor, SMD; Manufacturer: Vishay; Tolerance: ±1%; OrderingCode: CRCW040212K0FK; Power: 0.063W; Resistance: 12k; Temp_ Max: 155; Temp_ Min: -55; PackageDescription: SMD; Part Number: R0402_12k_0.063W_±1%; Price (€): 0,006
R12-R14 = R0402_10k_0.063W_±5%: as R1 on sheet [2]_FPGA; PackageDescription: SMD; Part Number: R0402_10k_0.063W_±5%; Price (€): 0,003
R16 = R0402_0R_0.063W_±5%: Resistor, SMD; Manufacturer: Panasonic; Tolerance: ±5%; OrderingCode: ERJ-2GE0R00X; Power: 0.063W; Resistance: 0R; Temp_ Max: 155; Temp_ Min: -55; OrderingCode 2: CRCW04020000Z0; PackageDescription: SMD; Part Number: R0402_0R_0.063W_±5%; Price (€): 0,003; Manufacturer 2: Vishay
U3 = FT2232H: Dual High Speed USB to Multipurpose UART/FIFO IC; Manufacturer: FTDI; OrderingCode: FT2232HQ-REEL; Temp_ Max: 85; Temp_ Min: -40; Part Number: FT2232H; Supplier: Silica; Price (€): 3,45
U4 = DSC1001-12MHZ: Oscillator, Low-Power CMOS, 4 pin, 1.8-3.3V; Manufacturer: Microchip; OrderingCode: DSC1001CL2-012.0000; Temp_ Max: 105; Temp_ Min: -40; Value: 12MHz; Part Number: DSC1001-12MHZ; Price (€): 0,61
U5 = 93LC56C: EEPROM, 2K Microwire Compatible Serial, 8 or 16 bit word size, 2.5-5.5 Vcc range; Manufacturer: Microchip; OrderingCode: 93LC56CT-I/MS; Temp_ Max: 85; Temp_ Min: -40; Value: 2Kb; Part Number: 93LC56C; Supplier: Silica; Price (€): 0,24

## Sheet [4]_Connectors_&_IO.SchDoc: Connectors & I/O
size A3; Author: Eladio Delgado Mingorance; CompanyName: Mareldem Technologies; Organization: Mareldem Technologies; Revision: 1.1; SheetNumber: 4; SheetTotal: 5
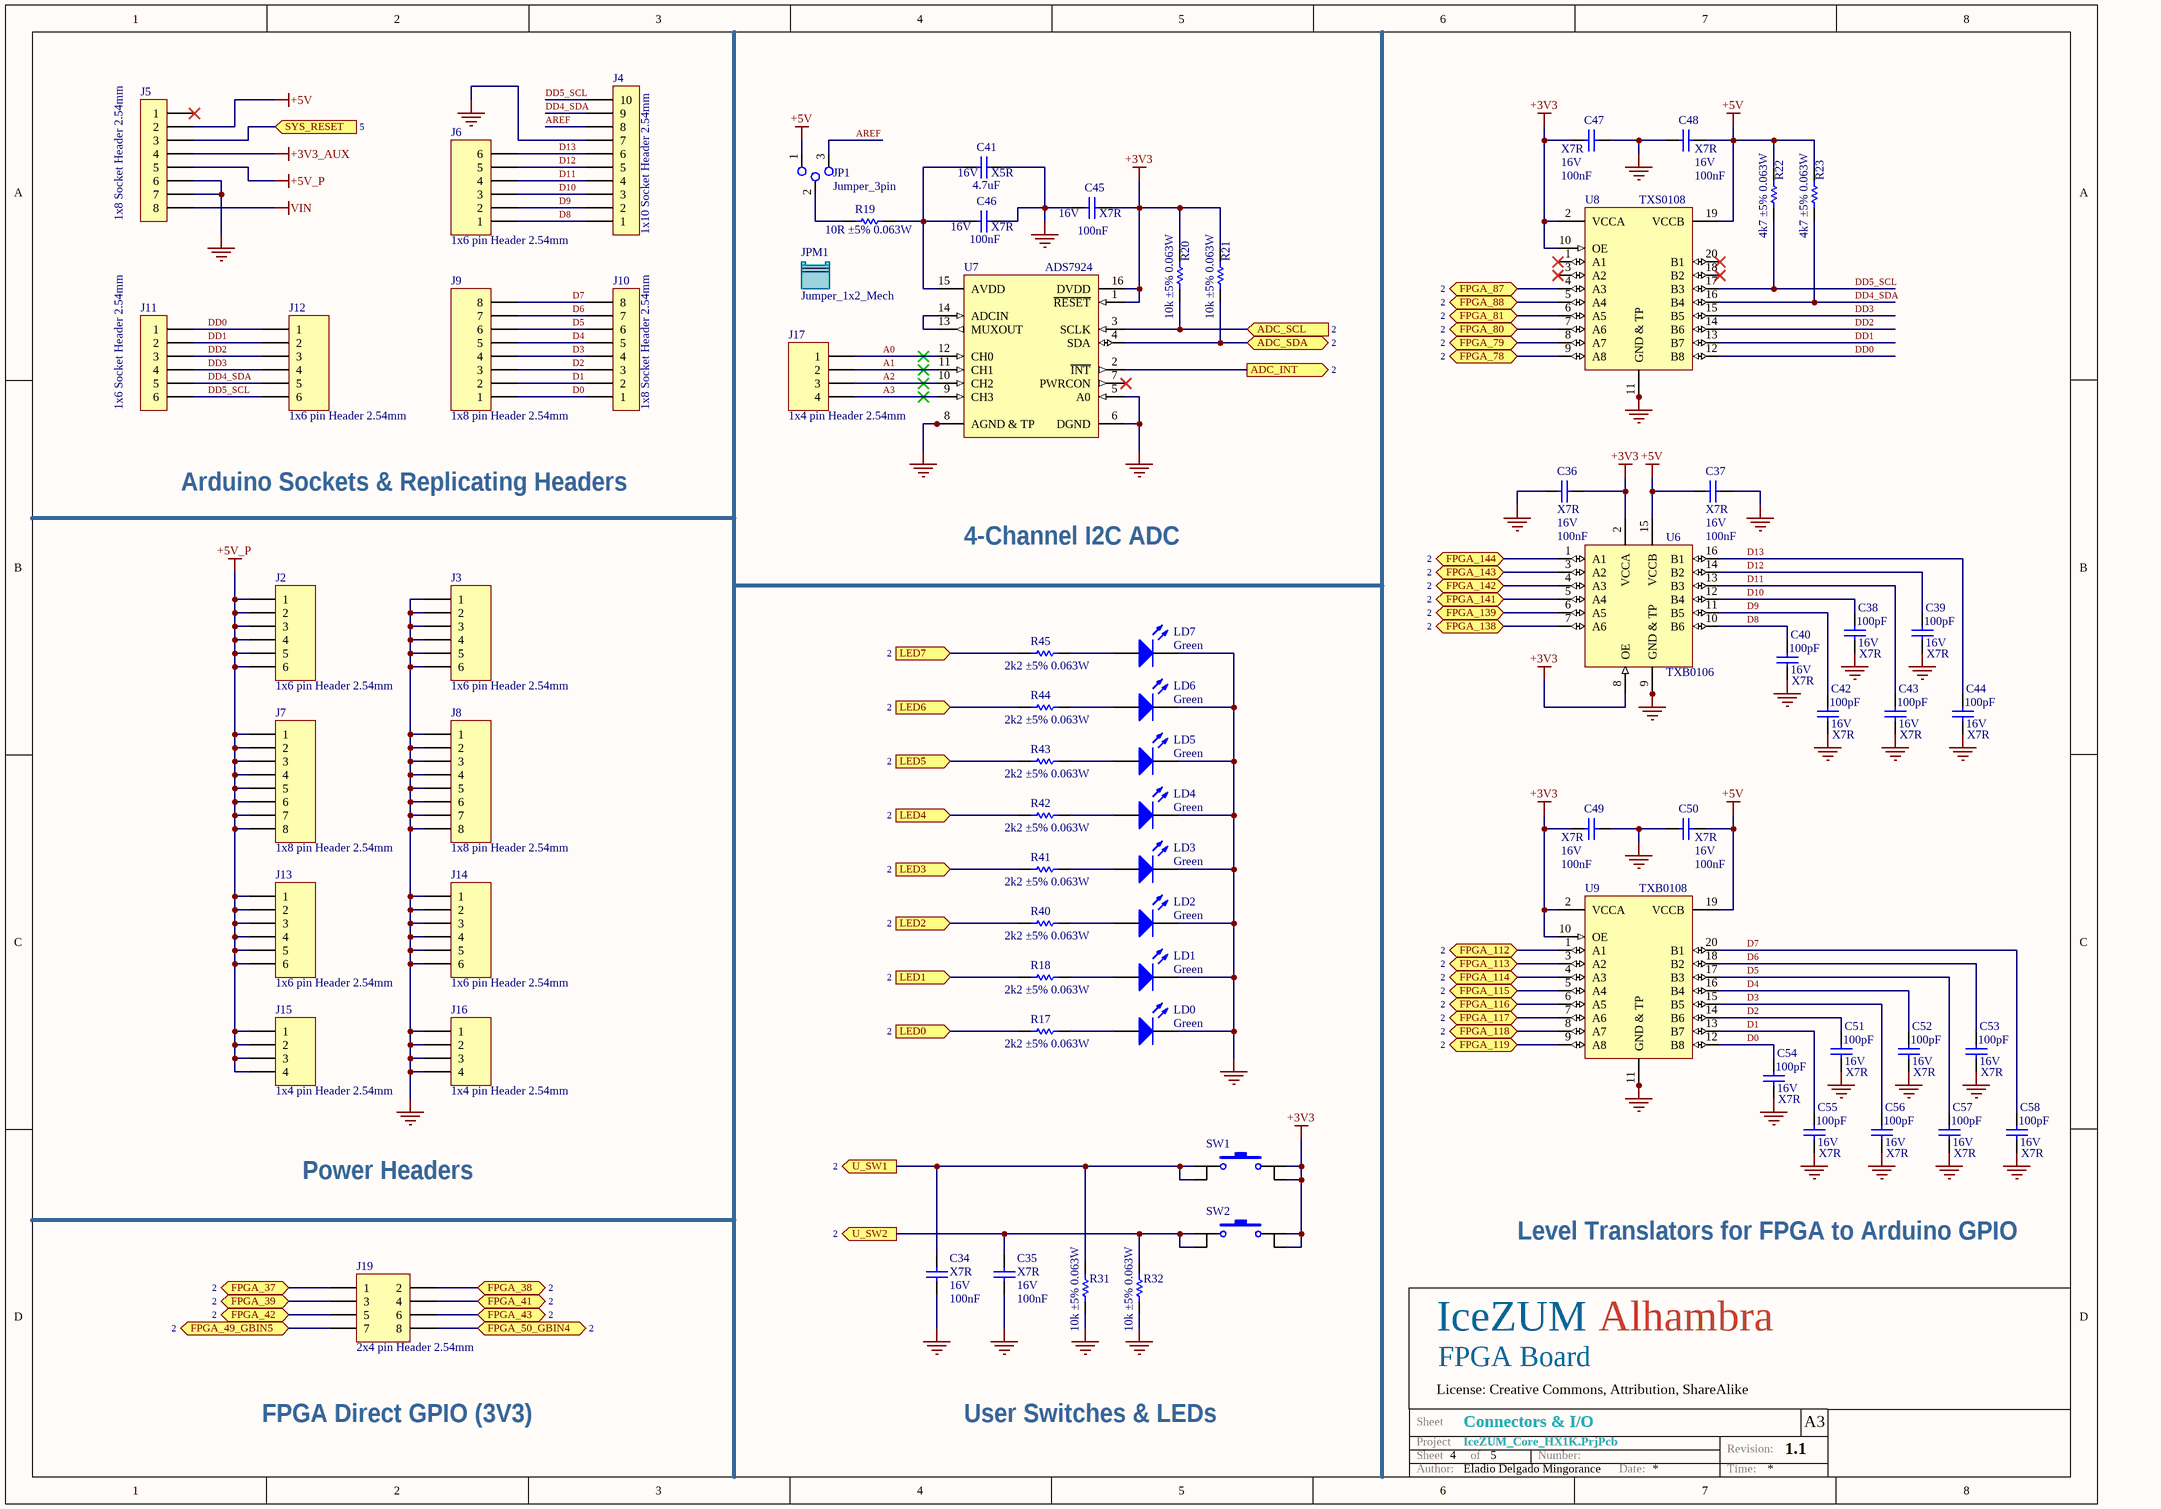
[diagram p3: [4]_Connectors_&_IO.SchDoc]

### Parts
C34  Dielectric: X7R  Voltage: 16V  Capacitance: 100nF  [C0402]  (hidden comment: Capacitor)
C35  Dielectric: X7R  Voltage: 16V  Capacitance: 100nF  [C0402]  (hidden comment: Capacitor)
C36  Dielectric: X7R  Voltage: 16V  Capacitance: 100nF  [C0402]  (hidden comment: Capacitor)
C37  Dielectric: X7R  Voltage: 16V  Capacitance: 100nF  [C0402]  (hidden comment: Capacitor)
C38  Dielectric: X7R  Voltage: 16V  Capacitance: 100pF  [C0402]  (hidden comment: Capacitor)
C39  Dielectric: X7R  Voltage: 16V  Capacitance: 100pF  [C0402]  (hidden comment: Capacitor)
C40  Dielectric: X7R  Voltage: 16V  Capacitance: 100pF  [C0402]  (hidden comment: Capacitor)
C41  Dielectric: X5R  Voltage: 16V  Capacitance: 4.7uF  [C0603]  (hidden comment: Capacitor)
C42  Dielectric: X7R  Voltage: 16V  Capacitance: 100pF  [C0402]  (hidden comment: Capacitor)
C43  Dielectric: X7R  Voltage: 16V  Capacitance: 100pF  [C0402]  (hidden comment: Capacitor)
C44  Dielectric: X7R  Voltage: 16V  Capacitance: 100pF  [C0402]  (hidden comment: Capacitor)
C45  Dielectric: X7R  Voltage: 16V  Capacitance: 100nF  [C0402]  (hidden comment: Capacitor)
C46  Dielectric: X7R  Voltage: 16V  Capacitance: 100nF  [C0402]  (hidden comment: Capacitor)
C47  Dielectric: X7R  Voltage: 16V  Capacitance: 100nF  [C0402]  (hidden comment: Capacitor)
C48  Dielectric: X7R  Voltage: 16V  Capacitance: 100nF  [C0402]  (hidden comment: Capacitor)
C49  Dielectric: X7R  Voltage: 16V  Capacitance: 100nF  [C0402]  (hidden comment: Capacitor)
C50  Dielectric: X7R  Voltage: 16V  Capacitance: 100nF  [C0402]  (hidden comment: Capacitor)
C51  Dielectric: X7R  Voltage: 16V  Capacitance: 100pF  [C0402]  (hidden comment: Capacitor)
C52  Dielectric: X7R  Voltage: 16V  Capacitance: 100pF  [C0402]  (hidden comment: Capacitor)
C53  Dielectric: X7R  Voltage: 16V  Capacitance: 100pF  [C0402]  (hidden comment: Capacitor)
C54  Dielectric: X7R  Voltage: 16V  Capacitance: 100pF  [C0402]  (hidden comment: Capacitor)
C55  Dielectric: X7R  Voltage: 16V  Capacitance: 100pF  [C0402]  (hidden comment: Capacitor)
C56  Dielectric: X7R  Voltage: 16V  Capacitance: 100pF  [C0402]  (hidden comment: Capacitor)
C57  Dielectric: X7R  Voltage: 16V  Capacitance: 100pF  [C0402]  (hidden comment: Capacitor)
C58  Dielectric: X7R  Voltage: 16V  Capacitance: 100pF  [C0402]  (hidden comment: Capacitor)
J2  1x6 pin Header 2.54mm  [1x6 Pin Header 2.54 Red]
J3  1x6 pin Header 2.54mm  [1x6 Pin Header 2.54]
J4  1x10 Socket Header 2.54mm  [1x10 Socket Header THT 2.54mm]
J5  1x8 Socket Header 2.54mm  [1x8 Socket Header THT 2.54mm]
J6  1x6 pin Header 2.54mm  [1x6 Pin Header 2.54 White]
J7  1x8 pin Header 2.54mm  [1x8 Pin Header 2.54 Red]
J8  1x8 pin Header 2.54mm  [1x8 Pin Header 2.54]
J9  1x8 pin Header 2.54mm  [1x8 Pin Header 2.54 White]
J10  1x8 Socket Header 2.54mm  [1x8 Socket Header THT 2.54mm]
J11  1x6 Socket Header 2.54mm  [1x6 Socket Header THT 2.54mm]
J12  1x6 pin Header 2.54mm  [1x6 Pin Header 2.54 White]
J13  1x6 pin Header 2.54mm  [1x6 Pin Header 2.54 Red]
J14  1x6 pin Header 2.54mm  [1x6 Pin Header 2.54]
J15  1x4 pin Header 2.54mm  [1x4 Pin Header 2.54 Red]
J16  1x4 pin Header 2.54mm  [1x4 Pin Header 2.54]
J17  1x4 pin Header 2.54mm  [1x4 Pin Header 2.54 Blue]
J19  2x4 pin Header 2.54mm  [2x4 Pin Header 2.54 Yellow]
JP1  Jumper_3pin  [1x3 Header 2.54 JP12]
JPM1  Jumper_1x2_Mech  (mechanical)
LD0  Green  [LED0603]
LD1  Green  [LED0603]
LD2  Green  [LED0603]
LD3  Green  [LED0603]
LD4  Green  [LED0603]
LD5  Green  [LED0603]
LD6  Green  [LED0603]
LD7  Green  [LED0603]
R17  value 2k2 ±5% 0.063W  [R0402]  (hidden comment: Resistor)
R18  value 2k2 ±5% 0.063W  [R0402]  (hidden comment: Resistor)
R19  value 10R ±5% 0.063W  [R0402]  (hidden comment: Resistor)
R20  value 10k ±5% 0.063W  [R0402]  (hidden comment: Resistor)
R21  value 10k ±5% 0.063W  [R0402]  (hidden comment: Resistor)
R22  value 4k7 ±5% 0.063W  [R0402]  (hidden comment: Resistor)
R23  value 4k7 ±5% 0.063W  [R0402]  (hidden comment: Resistor)
R31  value 10k ±5% 0.063W  [R0402]  (hidden comment: Resistor)
R32  value 10k ±5% 0.063W  [R0402]  (hidden comment: Resistor)
R40  value 2k2 ±5% 0.063W  [R0402]  (hidden comment: Resistor)
R41  value 2k2 ±5% 0.063W  [R0402]  (hidden comment: Resistor)
R42  value 2k2 ±5% 0.063W  [R0402]  (hidden comment: Resistor)
R43  value 2k2 ±5% 0.063W  [R0402]  (hidden comment: Resistor)
R44  value 2k2 ±5% 0.063W  [R0402]  (hidden comment: Resistor)
R45  value 2k2 ±5% 0.063W  [R0402]  (hidden comment: Resistor)
SW1  Switch_4P_SP  [WE_434331013822]  (value not drawn)
SW2  Switch_4P_SP  [WE_434331013822]  (value not drawn)
U6  TXB0106  [QFN16]
U7  ADS7924  [QFN16]
U8  TXS0108  [VQFN20 4.5x3.5mm]
U9  TXB0108  [VQFN20 4.5x3.5mm]

### Ports
ADC_INT (out, see 2), ADC_SCL (in, see 2), ADC_SDA (bidir, see 2), FPGA_37 (bidir, see 2), FPGA_38 (bidir, see 2), FPGA_39 (bidir, see 2), FPGA_41 (bidir, see 2), FPGA_42 (bidir, see 2), FPGA_43 (bidir, see 2), FPGA_49_GBIN5 (bidir, see 2), FPGA_50_GBIN4 (bidir, see 2), FPGA_78 (bidir, see 2), FPGA_79 (bidir, see 2), FPGA_80 (bidir, see 2), FPGA_81 (bidir, see 2), FPGA_87 (bidir, see 2), FPGA_88 (bidir, see 2), FPGA_112 (bidir, see 2), FPGA_113 (bidir, see 2), FPGA_114 (bidir, see 2), FPGA_115 (bidir, see 2), FPGA_116 (bidir, see 2), FPGA_117 (bidir, see 2), FPGA_118 (bidir, see 2), FPGA_119 (bidir, see 2), FPGA_138 (bidir, see 2), FPGA_139 (bidir, see 2), FPGA_141 (bidir, see 2), FPGA_142 (bidir, see 2), FPGA_143 (bidir, see 2), FPGA_144 (bidir, see 2), LED0 (in, see 2), LED1 (in, see 2), LED2 (in, see 2), LED3 (in, see 2), LED4 (in, see 2), LED5 (in, see 2), LED6 (in, see 2), LED7 (in, see 2), SYS_RESET (in, see 5), U_SW1 (out, see 2), U_SW2 (out, see 2)

### Nets
+3V3: C36.1 C45.2 C47.2 C49.2 R20.2 R21.2 SW1.3 SW1.4 SW2.3 SW2.4 U6.2(VCCA) U6.8(OE) U7.1(~{RESET}) U7.16(DVDD) U8.2(VCCA) U8.10(OE) U9.2(VCCA) U9.10(OE)
+3V3_AUX: J5.4
+5V: C37.2 C48.1 C50.1 J5.2 JP1.1 R22.2 R23.2 U6.15(VCCB) U8.19(VCCB) U9.19(VCCB)
+5V_P: J2.1 J2.2 J2.3 J2.4 J2.5 J2.6 J5.5 J7.1 J7.2 J7.3 J7.4 J7.5 J7.6 J7.7 J7.8 J13.1 J13.2 J13.3 J13.4 J13.5 J13.6 J15.1 J15.2 J15.3 J15.4
GND: C34.1 C35.1 C36.2 C37.1 C38.1 C39.1 C40.1 C41.1 C42.1 C43.1 C44.1 C45.1 C46.2 C47.1 C48.2 C49.1 C50.2 C51.1 C52.1 C53.1 C54.1 C55.1 C56.1 C57.1 C58.1 J3.1 J3.2 J3.3 J3.4 J3.5 J3.6 J4.7 J5.6 J5.7 J8.1 J8.2 J8.3 J8.4 J8.5 J8.6 J8.7 J8.8 J14.1 J14.2 J14.3 J14.4 J14.5 J14.6 J16.1 J16.2 J16.3 J16.4 LD0.K LD1.K LD2.K LD3.K LD4.K LD5.K LD6.K LD7.K R31.1 R32.1 U6.0(TP) U6.9(GND_&_TP) U7.0(TP) U7.5(A0) U7.6(DGND) U7.8(AGND_&_TP) U8.0(TP) U8.11(GND_&_TP) U9.0(TP) U9.11(GND_&_TP)
VIN: J5.8
A0: J17.1 U7.12(CH0)
A1: J17.2 U7.11(CH1)
A2: J17.3 U7.10(CH2)
A3: J17.4 U7.9(CH3)
AREF: J4.8 JP1.3
D0: C54.2 J9.1 J10.1 U9.12(B8)
D1: C55.2 J9.2 J10.2 U9.13(B7)
D2: C51.2 J9.3 J10.3 U9.14(B6)
D3: C56.2 J9.4 J10.4 U9.15(B5)
D4: C52.2 J9.5 J10.5 U9.16(B4)
D5: C57.2 J9.6 J10.6 U9.17(B3)
D6: C53.2 J9.7 J10.7 U9.18(B2)
D7: C58.2 J9.8 J10.8 U9.20(B1)
D8: C40.2 J4.1 J6.1 U6.10(B6)
D9: C42.2 J4.2 J6.2 U6.11(B5)
D10: C38.2 J4.3 J6.3 U6.12(B4)
D11: C43.2 J4.4 J6.4 U6.13(B3)
D12: C39.2 J4.5 J6.5 U6.14(B2)
D13: C44.2 J4.6 J6.6 U6.16(B1)
DD0: J11.1 J12.1 U8.12(B8)
DD1: J11.2 J12.2 U8.13(B7)
DD2: J11.3 J12.3 U8.14(B6)
DD3: J11.4 J12.4 U8.15(B5)
DD4_SDA: J4.9 J11.5 J12.5 R23.1 U8.16(B4)
DD5_SCL: J4.10 J11.6 J12.6 R22.1 U8.17(B3)
NetC34_2: C34.2 R31.2 SW1.1 SW1.2 ; port U_SW1
NetC35_2: C35.2 R32.2 SW2.1 SW2.2 ; port U_SW2
NetC41_2: C41.2 C46.1 R19.2 U7.15(AVDD)
NetD4_k: J5.3 ; port SYS_RESET
NetJ19_1: J19.1 ; port FPGA_37
NetJ19_2: J19.2 ; port FPGA_38
NetJ19_3: J19.3 ; port FPGA_39
NetJ19_4: J19.4 ; port FPGA_41
NetJ19_5: J19.5 ; port FPGA_42
NetJ19_6: J19.6 ; port FPGA_43
NetJ19_7: J19.7 ; port FPGA_49_GBIN5
NetJ19_8: J19.8 ; port FPGA_50_GBIN4
NetJP1_2: JP1.2 R19.1
NetLD0_A: LD0.A R17.2
NetLD1_A: LD1.A R18.2
NetLD2_A: LD2.A R40.2
NetLD3_A: LD3.A R41.2
NetLD4_A: LD4.A R42.2
NetLD5_A: LD5.A R43.2
NetLD6_A: LD6.A R44.2
NetLD7_A: LD7.A R45.2
NetR17_1: R17.1 ; port LED0
NetR18_1: R18.1 ; port LED1
NetR20_1: R20.1 U7.3(SCLK) ; port ADC_SCL
NetR21_1: R21.1 U7.4(SDA) ; port ADC_SDA
NetR40_1: R40.1 ; port LED2
NetR41_1: R41.1 ; port LED3
NetR42_1: R42.1 ; port LED4
NetR43_1: R43.1 ; port LED5
NetR44_1: R44.1 ; port LED6
NetR45_1: R45.1 ; port LED7
NetU1_78: U8.9(A8) ; port FPGA_78
NetU1_79: U8.8(A7) ; port FPGA_79
NetU1_80: U8.7(A6) ; port FPGA_80
NetU1_81: U8.6(A5) ; port FPGA_81
NetU1_87: U8.4(A3) ; port FPGA_87
NetU1_88: U8.5(A4) ; port FPGA_88
NetU1_93: U7.2(~{INT}) ; port ADC_INT
NetU1_112: U9.1(A1) ; port FPGA_112
NetU1_113: U9.3(A2) ; port FPGA_113
NetU1_114: U9.4(A3) ; port FPGA_114
NetU1_115: U9.5(A4) ; port FPGA_115
NetU1_116: U9.6(A5) ; port FPGA_116
NetU1_117: U9.7(A6) ; port FPGA_117
NetU1_118: U9.8(A7) ; port FPGA_118
NetU1_119: U9.9(A8) ; port FPGA_119
NetU1_138: U6.7(A6) ; port FPGA_138
NetU1_139: U6.6(A5) ; port FPGA_139
NetU1_141: U6.5(A4) ; port FPGA_141
NetU1_142: U6.4(A3) ; port FPGA_142
NetU1_143: U6.3(A2) ; port FPGA_143
NetU1_144: U6.1(A1) ; port FPGA_144
NetU7_13: U7.13(MUXOUT) U7.14(ADCIN)

Not connected (* = marked no-connect by the designer): J5 1*; U7 7(PWRCON)*; U8 1(A1)* 3(A2)* 18(B2)* 20(B1)*

### Notes on the sheet
- Arduino Sockets & Replicating Headers
- 4-Channel I2C ADC
- Power Headers
- Level Translators for FPGA to Arduino GPIO
- FPGA Direct GPIO (3V3)
- User Switches & LEDs
- License: Creative Commons, Attribution, ShareAlike
- IceZUM
- FPGA Board
- Alhambra
- Project
- Sheet
- Sheet         of
- Number:
- Revision:
- A3
- Author:
- Date:
- Time:

### Library data of the parts
C34-C37 C45-C50 = C0402_100nF_16V_±10%: as C1 on sheet [2]_FPGA; Part Number: C0402_100nF_16V_±10%; Price (€): 0,05
C38-C40 C42-C44 C51-C58 = C0402_100pF_16V_±10%: Capacitor SMD; Manufacturer: Kemet; Value: 100pF ±10% 16V; Tolerance: ±10%; OrderingCode: C0402C101K4RAC; Temp_ Max: 125; Temp_ Min: -55; Part Number: C0402_100pF_16V_±10%; Price (€): 0,036
C41 = C0603_4.7uF_16V_±10%: as C17 on sheet [3]_USB_Interface; Part Number: C0603_4.7uF_16V_±10%; Price (€): 0,068
J2 J13 = CON_PH_THT2.54_6 Red: Manufacturer: Samtec; OrderingCode: TSW-106-07-T-S-RED; Temp_ Max: 125; Temp_ Min: -40; Pitch: 2.54mm; Part Number: CON_PH_THT2.54_6 Red; Supplier: Samtec; Price (€): 0,26
J3 J14 = CON_PH_THT2.54_6: Manufacturer: Samtec; OrderingCode: TSW-106-07-T-S; Temp_ Max: 125; Temp_ Min: -40; Value: 6; OrderingCode 2: 613 006 111 21; Pitch: 2.54mm; Part Number: CON_PH_THT2.54_6; Supplier: Samtec; Price (€): 0,26; Manufacturer 2: Würth Elektronik
J4 = CON_SH_THT2.54_10: Connector, 10 pin Socket Header 2.54mm; Manufacturer: Samtec; OrderingCode: SSW-110-01-T-S; Temp_ Max: 125; Temp_ Min: -40; OrderingCode 2: 613 010 118 21; Value: 10; Pitch: 2.54mm; Part Number: CON_SH_THT2.54_10; Supplier: Samtec; Price (€): 0,578; Manufacturer 2: Würth Elektronik
J5 J10 = CON_SH_THT2.54_8: 8 pin Socket Header 2.54mm; Manufacturer: Samtec; OrderingCode: SSW-108-01-T-S; Temp_ Max: 125; Temp_ Min: -40; Value: 8; OrderingCode 2: 613 008 118 21; Pitch: 2.54mm; Part Number: CON_SH_THT2.54_8; Supplier: Samtec; Price (€): 0,438; Manufacturer 2: Würth Elektronik
J6 = CON_PH_THT2.54_6 Natural: Manufacturer: Samtec; OrderingCode: TSW-106-07-T-S-NATURAL; Temp_ Max: 125; Temp_ Min: -40; Pitch: 2.54mm; Part Number: CON_PH_THT2.54_6 Natural; Supplier: Samtec; Price (€): 0,26
J7 = CON_PH_THT2.54_8 Red: Manufacturer: Samtec; OrderingCode: TSW-108-07-T-S-RED; Temp_ Max: 125; Temp_ Min: -40; Pitch: 2.54mm; Part Number: CON_PH_THT2.54_8 Red; Supplier: Samtec; Price (€): 0,35
J8 = CON_PH_THT2.54_8: Manufacturer: Samtec; OrderingCode: TSW-108-07-T-S; Temp_ Max: 125; Temp_ Min: -40; Value: 8; OrderingCode 2: 613 008 111 21; Pitch: 2.54mm; Part Number: CON_PH_THT2.54_8; Supplier: Samtec; Price (€): 0,35; Manufacturer 2: Würth Elektronik
J9 = CON_PH_THT2.54_8 Natural: Manufacturer: Samtec; OrderingCode: TSW-108-07-T-S-NATURAL; Temp_ Max: 125; Temp_ Min: -40; Pitch: 2.54mm; Part Number: CON_PH_THT2.54_8 Natural; Supplier: Samtec; Price (€): 0,35
J11 = CON_SH_THT2.54_6: 6 pin Socket Header 2.54mm; Manufacturer: Samtec; OrderingCode: SSW-106-01-T-S; Temp_ Max: 125; Temp_ Min: -40; Value: 6; OrderingCode 2: 613 006 118 21; Pitch: 2.54mm; Part Number: CON_SH_THT2.54_6; Supplier: Samtec; Price (€): 0,381; Manufacturer 2: Würth Elektronik
J12 = CON_PH_THT2.54_6 Natural: Connector, 1x6 pin Header 2.54mm; Manufacturer: Samtec; OrderingCode: TSW-106-07-T-S-NATURAL; Temp_ Max: 105; Temp_ Min: -55; Pitch: 2.54mm; Part Number: CON_PH_THT2.54_6 Natural; Supplier: Samtec; Price (€): 0,26
J15 = CON_PH_THT2.54_4 Red: Connector, 1x4 pin Header 2.54mm; Manufacturer: Samtec; OrderingCode: TSW-104-07-T-S-RED; Temp_ Max: 105; Temp_ Min: -55; Pitch: 2.54mm; Part Number: CON_PH_THT2.54_4 Red; Supplier: Samtec; Price (€): 0,23
J16 = CON_PH_THT2.54_4: Connector, 1x4 pin Header 2.54mm; Manufacturer: Samtec; OrderingCode: TSW-104-07-T-S; Temp_ Max: 105; Temp_ Min: -55; OrderingCode 2: 613 004 111 21; Value: 4; Pitch: 2.54mm; Part Number: CON_PH_THT2.54_4; Supplier: Samtec; Price (€): 0,211; Manufacturer 2: Würth Elektronik
J17 = CON_PH_THT2.54_4: Connector, 1x4 pin Header 2.54mm; Manufacturer: Samtec; Part Number: CON_PH_THT2.54_4 Blue; OrderingCode: TSW-104-07-T-S-BLUE; Temp_ Max: 105; Temp_ Min: -55; OrderingCode 2: 613 004 111 21; Value: 4; Pitch: 2.54mm; Supplier: Samtec; Price (€): 0,211; Manufacturer 2: Würth Elektronik
J19 = CON_DPH_THT2.54_8: Connector, 8 pin Dual Header 2.54mm; Manufacturer: Samtec; OrderingCode: TSW-104-07-T-D; Temp_ Max: 125; Temp_ Min: -40; OrderingCode 2: 613 008 211 21; Value: 8; Pitch: 2.54mm; Part Number: CON_DPH_THT2.54_8; Supplier: Samtec; Price (€): 0,305; Manufacturer 2: Würth Elektronik
JP1 = Jumper_3pin_THT_JP12: Connector, Jumper, 3 pin Male Header 2.54mm; Manufacturer: Würth; OrderingCode: 613 003 111 21 / 609 002 136 21; Temp_ Max: 125; Temp_ Min: -40; Value: 3; Part Number: Jumper_3pin_THT_JP12; Supplier: Würth; Price (€): 0,15
JPM1 = Jumper_2pin_Mech: Connector, Jumper, 1x2 Jumper 2.54mm; Manufacturer: Würth; OrderingCode: 609 002 136 21; Temp_ Max: 125; Temp_ Min: -40; Value: Blue 1x2; Part Number: Jumper_2pin_Mech; Supplier: Würth; Price (€): 0,05
LD0-LD7 = LED Green 0603: as LD8 on sheet [3]_USB_Interface; Part Number: LED Green 0603; Price (€): 0,058; Value: Green
R17 R18 R40-R45 = R0402_2k2_0.063W_±5%: as R46 on sheet [2]_FPGA; PackageDescription: SMD; Part Number: R0402_2k2_0.063W_±5%; Price (€): 0,003
R19 = R0402_10R_0.063W_±5%: Resistor, SMD; Manufacturer: Vishay; Tolerance: ±5%; OrderingCode: CRCW040210R0JN; Power: 0.063W; Resistance: 10R; Temp_ Max: 155; Temp_ Min: -55; PackageDescription: SMD; Part Number: R0402_10R_0.063W_±5%; Price (€): 0,003
R20 R21 R31 R32 = R0402_10k_0.063W_±5%: as R1 on sheet [2]_FPGA; PackageDescription: SMD; Part Number: R0402_10k_0.063W_±5%; Price (€): 0,003
R22 R23 = R0402_4k7_0.063W_±5%: Resistor, SMD; Manufacturer: Vishay; Tolerance: ±5%; OrderingCode: CRCW04024K70JN; Power: 0.063W; Resistance: 4k7; Temp_ Max: 155; Temp_ Min: -55; PackageDescription: SMD; Part Number: R0402_4k7_0.063W_±5%; Price (€): 0,003
SW1 SW2 = SW 3.5x2.9 mm SMD side push: Micro miniature pushbutton surface Switch; Manufacturer: Würth; OrderingCode: 434331013822; Temp_ Max: 85; Temp_ Min: -40; Part Number: SW 3.5x2.9 mm SMD side push; Supplier: Würth; Price (€): 0,2
U6 = TXB0106: Voltage Translator, Hex; Manufacturer: Texas Instruments; OrderingCode: TXB0106RGYR; Temp_ Max: 85; Temp_ Min: -40; Part Number: TXB0106; Supplier: Silica; Price (€): 0,7
U7 = ADS7924: ADC Converter, 12-Bit, 4-Ch, I2C; Manufacturer: Texas Instruments; OrderingCode: ADS7924IRTER; Temp_ Max: 85; Temp_ Min: -40; Part Number: ADS7924; Supplier: Silica; Price (€): 1,35
U8 = TXS0108: Voltage Level Translator, 8-Bit Bidir., with TP; Manufacturer: Texas Instruments; OrderingCode: TXS0108ERGYR; Temp_ Max: 85; Temp_ Min: -40; Part Number: TXS0108; Supplier: Silica; Price (€): 0,832
U9 = TXB0108: Voltage Level Translator, 8-Bit Bidir., with TP; Manufacturer: Texas Instruments; OrderingCode: TXB0108RGYR; Temp_ Max: 85; Temp_ Min: -40; Part Number: TXB0108; Supplier: Silica; Price (€): 0,832

## Sheet [5]_Power_Supply.SchDoc: Power Supply
size A3; Author: Eladio Delgado Mingorance; CompanyName: Mareldem Technologies; Organization: Mareldem Technologies; Revision: 1.1; SheetNumber: 5; SheetTotal: 5
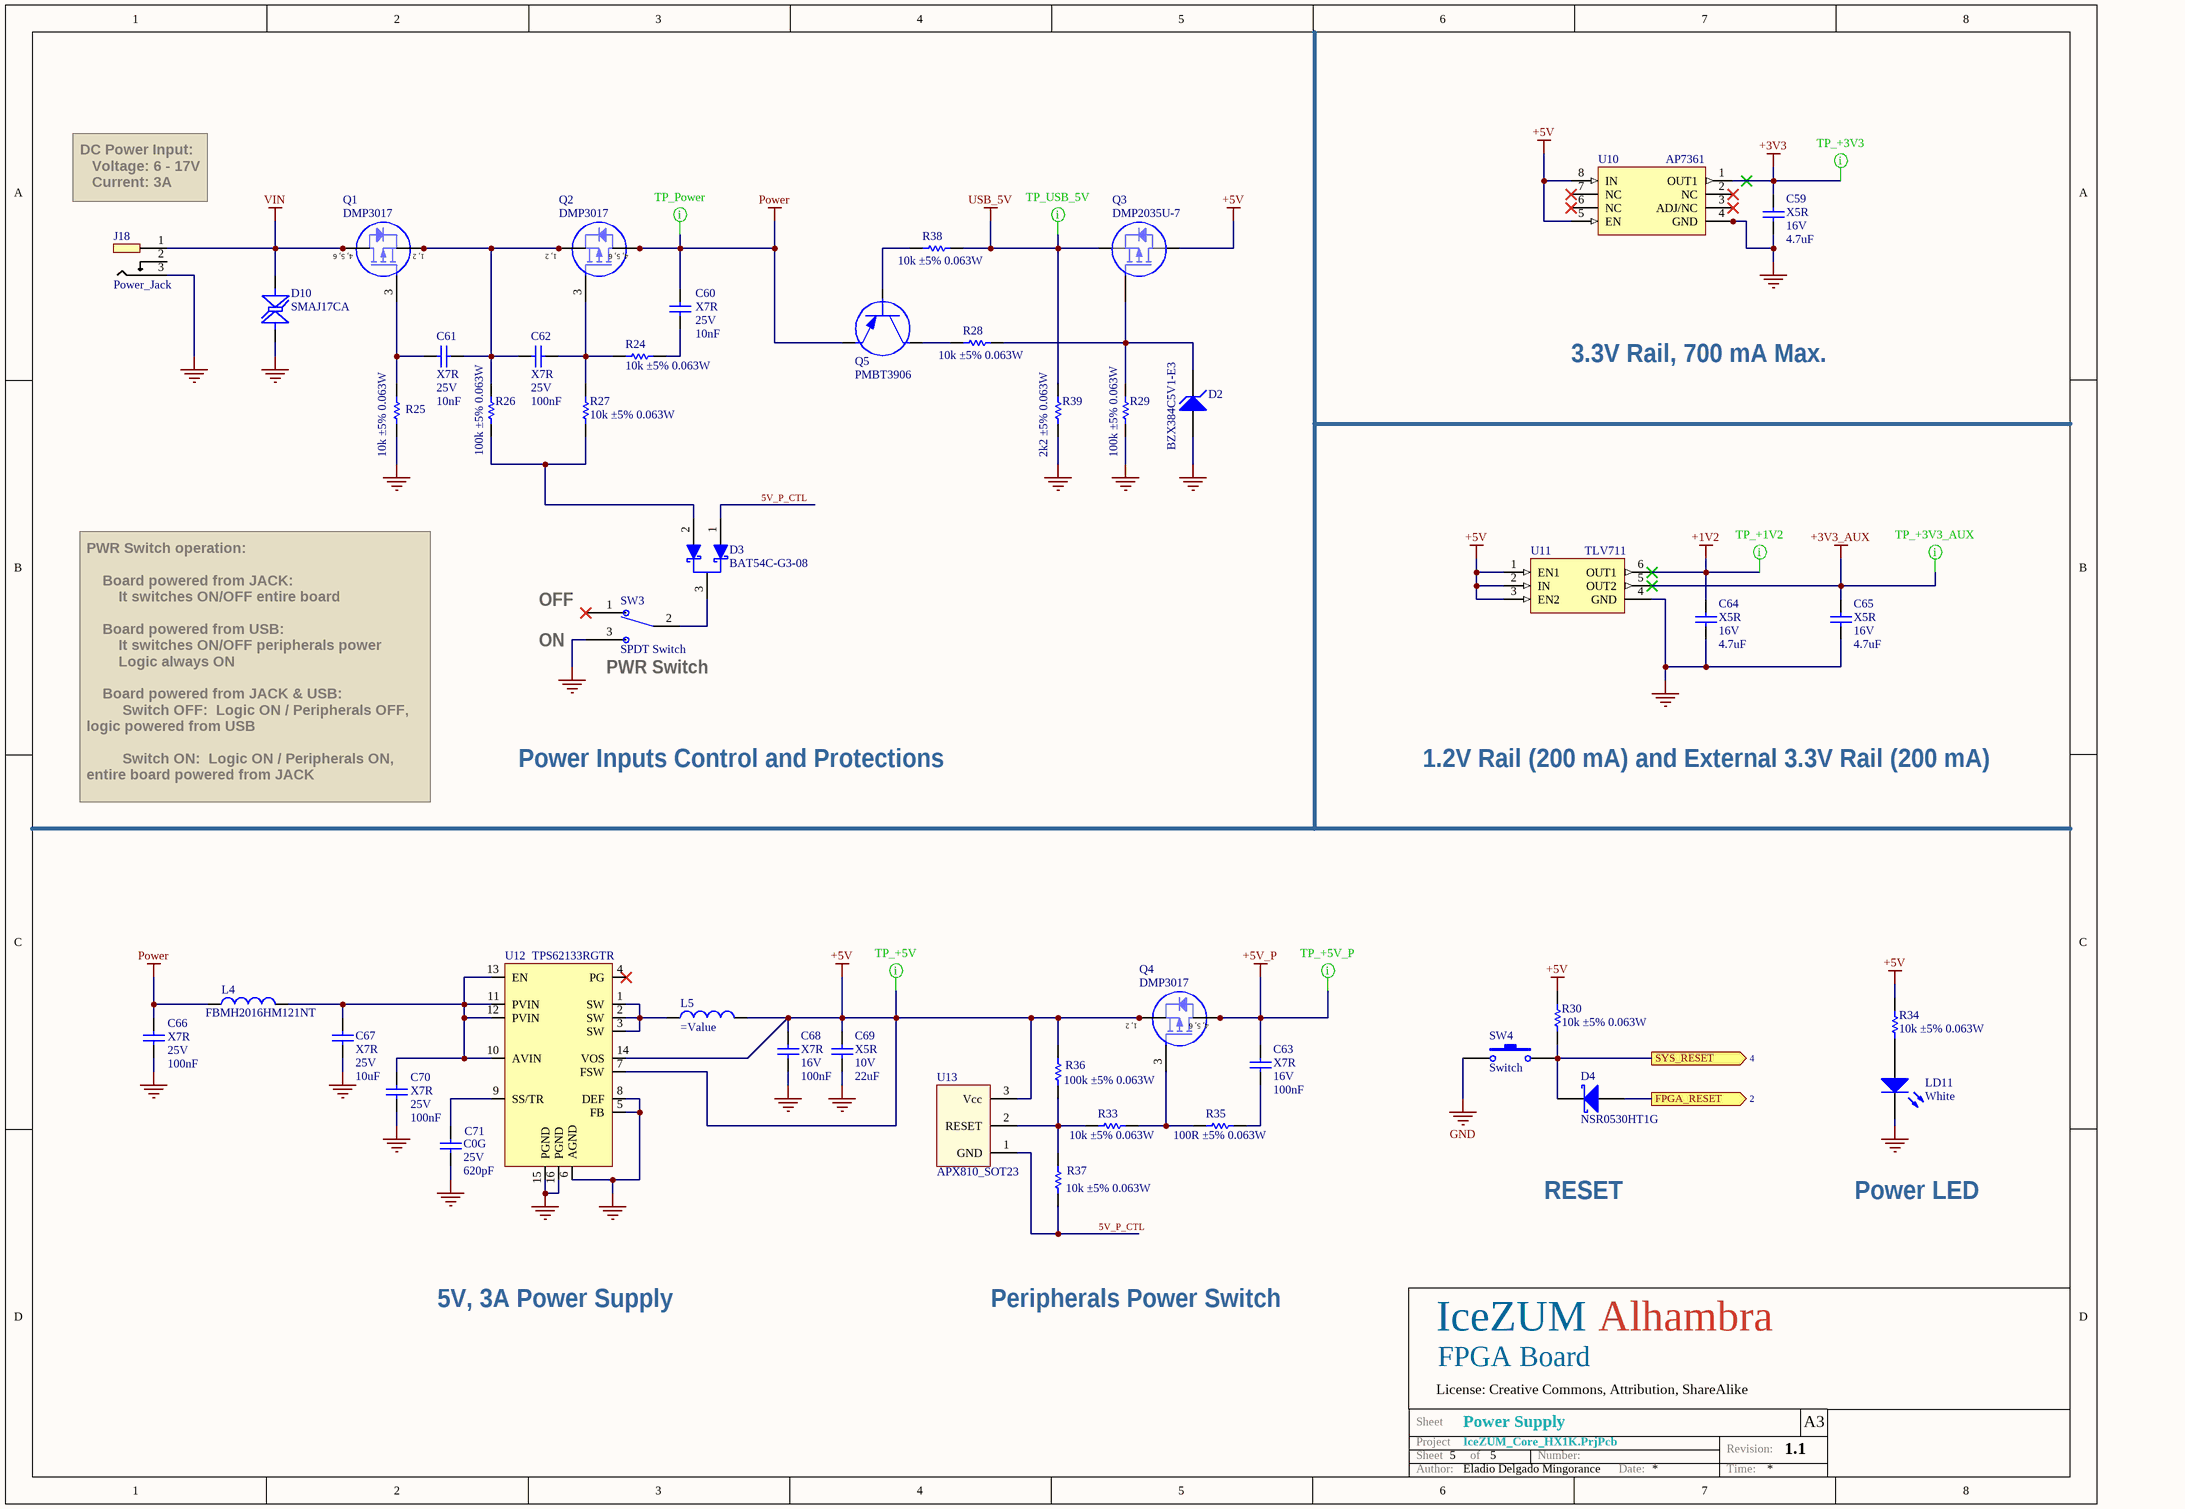
[diagram p4: [5]_Power_Supply.SchDoc]

### Parts
C59  Dielectric: X5R  Voltage: 16V  Capacitance: 4.7uF  [C0603]  (hidden comment: Capacitor)
C60  Dielectric: X7R  Voltage: 25V  Capacitance: 10nF  [C0603]  (hidden comment: Capacitor)
C61  Dielectric: X7R  Voltage: 25V  Capacitance: 10nF  [C0603]  (hidden comment: Capacitor)
C62  Dielectric: X7R  Voltage: 25V  Capacitance: 100nF  [C0603]  (hidden comment: Capacitor)
C63  Dielectric: X7R  Voltage: 16V  Capacitance: 100nF  [C0402]  (hidden comment: Capacitor)
C64  Dielectric: X5R  Voltage: 16V  Capacitance: 4.7uF  [C0603]  (hidden comment: Capacitor)
C65  Dielectric: X5R  Voltage: 16V  Capacitance: 4.7uF  [C0603]  (hidden comment: Capacitor)
C66  Dielectric: X7R  Voltage: 25V  Capacitance: 100nF  [C0603]  (hidden comment: Capacitor)
C67  Dielectric: X7R  Voltage: 25V  Capacitance: 10uF  [C1206]  (hidden comment: Capacitor)
C68  Dielectric: X7R  Voltage: 16V  Capacitance: 100nF  [C0402]  (hidden comment: Capacitor)
C69  Dielectric: X5R  Voltage: 10V  Capacitance: 22uF  [C1206]  (hidden comment: Capacitor)
C70  Dielectric: X7R  Voltage: 25V  Capacitance: 100nF  [C0603]  (hidden comment: Capacitor)
C71  Dielectric: C0G  Voltage: 25V  Capacitance: 620pF  [C0603]  (hidden comment: Capacitor)
D2  BZX384C5V1-E3  [SOD323]
D3  BAT54C-G3-08  [SOT23-3]
D4  NSR0530HT1G  [SOD323]
D10  SMAJ17CA  [DO-214AC-SMA_Bidir]
J18  Power_Jack  [Jack 2.1]
L4  FBMH2016HM121NT  [L0806]
L5  (no value)  [L4040]
LD11  White  [LED0603]
Q1  DMP3017  [U-DFN2523-6]
Q2  DMP3017  [U-DFN2523-6]
Q3  DMP2035U-7  [SOT23-3]
Q4  DMP3017  [U-DFN2523-6]
Q5  PMBT3906  [SOT23-3]
R24  value 10k ±5% 0.063W  [R0402]  (hidden comment: Resistor)
R25  value 10k ±5% 0.063W  [R0402]  (hidden comment: Resistor)
R26  value 100k ±5% 0.063W  [R0402]  (hidden comment: Resistor)
R27  value 10k ±5% 0.063W  [R0402]  (hidden comment: Resistor)
R28  value 10k ±5% 0.063W  [R0402]  (hidden comment: Resistor)
R29  value 100k ±5% 0.063W  [R0402]  (hidden comment: Resistor)
R30  value 10k ±5% 0.063W  [R0402]  (hidden comment: Resistor)
R33  value 10k ±5% 0.063W  [R0402]  (hidden comment: Resistor)
R34  value 10k ±5% 0.063W  [R0402]  (hidden comment: Resistor)
R35  value 100R ±5% 0.063W  [R0402]  (hidden comment: Resistor)
R36  value 100k ±5% 0.063W  [R0402]  (hidden comment: Resistor)
R37  value 10k ±5% 0.063W  [R0402]  (hidden comment: Resistor)
R38  value 10k ±5% 0.063W  [R0402]  (hidden comment: Resistor)
R39  value 2k2 ±5% 0.063W  [R0402]  (hidden comment: Resistor)
SW3  SPDT Switch  [Slide SW SPDT Right Angle]
SW4  Switch  [SW_Vert_THT_7.5x6x6.5]
U10  AP7361  [U-DFN3030-8]
U11  TLV711  [WSON-6-1,5x1,5mm]
U12  TPS62133RGTR  [QFN16]
U13  APX810_SOT23  [SOT23-3]

### Ports
FPGA_RESET (out, see 2), SYS_RESET (out, see 4)

### Nets
+1V2: C64.2 U11.6(OUT1)
+3V3: C59.2 U10.1(OUT1)
+3V3_AUX: C65.2 U11.5(OUT2)
+5V: C68.2 C69.2 L5.2 Q3.3(D) Q4.1(S) Q4.2(S) R30.2 R34.2 R36.1 U10.5(EN) U10.8(IN) U11.1(EN1) U11.2(IN) U11.3(EN2) U12.7(FSW) U12.14(VOS) U13.3(Vcc)
+5V_P: C63.2 Q4.4(D) Q4.5(D) Q4.6(D)
GND: C59.1 C64.1 C65.1 C66.1 C67.1 C68.1 C69.1 C70.1 C71.1 D2.A D10.A J18.3 LD11.K R25.2 R29.1 R39.1 SW3.3 SW4.2 U10.0(TP) U10.4(GND) U11.4(GND) U12.5(FB) U12.6(AGND) U12.8(DEF) U12.15(PGND) U12.16(PGND)
Power: C60.2 C66.2 L4.1 Q2.4(D) Q2.5(D) Q2.6(D) Q5.2(E)
USB_5V: Q3.2(S) R38.2 R39.2
VIN: D10.K J18.1 Q1.4(D) Q1.5(D) Q1.6(D)
5V_P_CTL: D3.1(A1) R37.2 U13.1(GND)
NetC60_1: C60.1 R24.2
NetC61_1: C61.1 C62.2 Q1.1(S) Q1.2(S) Q2.1(S) Q2.2(S) R26.1
NetC61_2: C61.2 Q1.3(G) R25.1
NetC62_1: C62.1 Q2.3(G) R24.1 R27.1
NetC63_1: C63.1 R35.2
NetC67_2: C67.2 C70.2 L4.2 U12.10(AVIN) U12.11(PVIN) U12.12(PVIN) U12.13(EN)
NetC71_2: C71.2 U12.9(SS/TR)
NetD2_k: D2.k(K) Q3.1(G) R28.2 R29.2
NetD3_2: D3.2(A2) R26.2 R27.2
NetD3_3: D3.3(K) SW3.2
NetD4_A: D4.A ; port FPGA_RESET
NetD4_k: D4.k(K) R30.1 SW4.1 ; port SYS_RESET
NetL5_1: L5.1 U12.1(SW) U12.2(SW) U12.3(SW)
NetLD11_A: LD11.A R34.1
NetQ4_3: Q4.3(G) R33.2 R35.1
NetQ5_1: Q5.1(B) R38.1
NetQ5_3: Q5.3(C) R28.1
NetR33_1: R33.1 R36.2 R37.1 U13.2(RESET)

Not connected (* = marked no-connect by the designer): J18 2; SW3 1*; U10 2(NC)* 3(ADJ/NC)* 6(NC)* 7(NC)*; U12 4(PG)*

### Layout directives
net class Test Points: +1V2, +3V3, +3V3_AUX, +5V, +5V_P, Power, USB_5V

### Notes on the sheet
- (near J18) DC Power Input:
  Voltage: 6 - 17V
  Current: 3A
- 3.3V Rail, 700 mA Max.
- ON
- OFF
- (near SW3) PWR Switch
- Power Inputs Control and Protections
- 1.2V Rail (200 mA) and External 3.3V Rail (200 mA)
- PWR Switch operation:
  Board powered from JACK:
  It switches ON/OFF entire board
  Board powered from USB:
  It switches ON/OFF peripherals power
  Logic always ON
  Board powered from JACK & USB:
  Switch OFF: 	Logic ON / Peripherals OFF,                            		logic powered from USB
  Switch ON: 	Logic ON / Peripherals ON,                                   		entire board powered from JACK
- RESET
- Power LED
- 5V, 3A Power Supply
- Peripherals Power Switch
- License: Creative Commons, Attribution, ShareAlike
- IceZUM
- FPGA Board
- Alhambra
- Project
- Sheet
- Sheet         of
- Number:
- Revision:
- A3
- Author:
- Date:
- Time:
- (in symbol DMP3017) 4, 5, 6; 1, 2

### Library data of the parts
C59 C64 C65 = C0603_4.7uF_16V_±10%: as C17 on sheet [3]_USB_Interface; Part Number: C0603_4.7uF_16V_±10%; Price (€): 0,068
C60 C61 = C0603_10nF_25V_±10%: as C32 on sheet [3]_USB_Interface; Part Number: C0603_10nF_25V_±10%; Price (€): 0,035
C62 = C0603_100nF_25V_±10%: Capacitor SMD; Manufacturer: Kemet; Value: 100nF ±10% 25V; Tolerance: ±10%; OrderingCode: C0603C104K3RAC; Temp_ Max: 125; Temp_ Min: -55; Part Number: C0603_100nF_25V_±10%; Price (€): 0,035
C63 C68 = C0402_100nF_16V_±10%: as C1 on sheet [2]_FPGA; Part Number: C0402_100nF_16V_±10%; Price (€): 0,05
C66 C70 = C0603_100nF_25V_±10%: Manufacturer: Kemet; Value: 100nF ±10% 25V; Tolerance: ±10%; OrderingCode: C0603C104K3RAC; Temp_ Max: 125; Temp_ Min: -55; Part Number: C0603_100nF_25V_±10%; Price (€): 0,035
C67 = C1206_10uF_25V_±10%: Capacitor SMD; Manufacturer: Taiyo Yuden; Value: 10uF ±10% 25V; Tolerance: ±10%; OrderingCode: TMK316B7106KL-TD; Temp_ Max: 125; Temp_ Min: -55; Part Number: C1206_10uF_25V_±10%; Price (€): 0,066
C69 = C1206_22uF_10V_±20%: Manufacturer: Taiyo Yuden; Value: 22uF ±20% 10V; Tolerance: ±20%; OrderingCode: LMK316ABJ226ML-T; Temp_ Max: 85; Temp_ Min: -55; Part Number: C1206_22uF_10V_±20%; Price (€): 0,094
C71 = C0603_620pF_25V_±5%: Manufacturer: Murata; Value: 620pF ±5% 25V; Tolerance: ±5%; OrderingCode: GRM1885C1E621JA01D; Temp_ Max: 125; Temp_ Min: -55; Part Number: C0603_620pF_25V_±5%; Price (€): 0,023
D2 = BZX384C5V1: Zener Diode; Manufacturer: Vishay; Vzener: 5V1; Tolerance: 0,05; Izener: 5mA; Power: 200mW; Temp_ Max: 150; Temp_ Min: -55; OrderingCode 2: BZX384B5V1-E3; Value: 5V1; Part Number: BZX384C5V1; OrderingCode: BZX384C5V1-E3; Price (€): 0,024; Manufacturer 2: Vishay
D3 = BAT54C: Dual Schottky Diode Common Cathode; Part Number: BAT54C; Manufacturer: Vishay; Ifor: 200mA; Vrrm: 30V; Ifsm: 600mA; Vf: 0,8V; Temp_ Max: 125; Temp_ Min: -55; Value: 200mA 30V; OrderingCode: BAT54C-G3-08; Price (€): 0,042; Manufacturer 2: Fairchild; OrderingCode 2: BAT54C
D4 = NSR0530HT1G: as D1 on sheet [2]_FPGA; Part Number: NSR0530HT1G; Ifsm: 500mA; OrderingCode: NSR0530HT1G; Price (€): 0,031
D10 = TVS 17V Bi SMA: Protection, Bidirectional Transient Suppression Diodes; Manufacturer: Bourns; Voltage: 17V; Breakdown Voltage: 18,9V; Overvoltage Current: 14,5A; Temp_ Max: 150; Temp_ Min: -55; Part Number: TVS 17V Bi SMA; OrderingCode: SMAJ17CA; Price (€): 0,113; Manufacturer 2: Littelfuse; OrderingCode 2: SMAJ17CA
J18 = DC Power Jack: Connector, Power, DC Power Jack; Manufacturer: Kycon; Idc: 5A; OrderingCode: KLDHCX0202A; OrderingCode 2: RAPC722X; Part Number: DC Power Jack; Supplier: Avnet; Price (€): 0,2673; Manufacturer 2: Switchcraft
L4 = L0806_120R_0,015R_4,5A: Ferrite Bead; Manufacturer: Taiyo Yuden; Resistance_100MHz: 120R; Resistance_DC: 0,015R; Current: 4,5A; Temp_ Max: 125; Temp_ Min: -40; Value: 120R 0,015R 4,5A; Part Number: L0806_120R_0,015R_4,5A; OrderingCode: FBMH2016HM121NT; Price (€): 0,05
L5 = 2,2uH_4,7A: Inductor SMD; Manufacturer: Würth Elektronik; L: 2,2uH; Rdc: 0,029R; Current: 4,7A; Current Sat#: 6,2A; OrderingCode: 74438356022; Temp_ Max: 125; Temp_ Min: -40; OrderingCode 2: XAL4020-222MEB; Value: 2,2uH 4,7A; Part Number: 2,2uH_4,7A; Supplier: Würth; Price (€): 1,22; Manufacturer 2: Coilcraft
LD11 = LW Q38G-Q2R3: LED; Manufacturer: OSRAM Opto; OrderingCode: LW Q38G-Q2R2-3K5L-1; Temp_ Max: 85; Temp_ Min: -40; Part Number: LW Q38G-Q2R3; Price (€): 0,1; Value: White
Q1 Q2 Q4 = DMP3017: P-Channel MOSFET, 6 pin; Manufacturer: Diodes Incorporated; Vds: 30V; Vgss: 25V; Id: 10,4A; OrderingCode: DMP3017SFK-7; Temp_ Max: 150; Temp_ Min: -55; Part Number: DMP3017; Supplier: Silica; Price (€): 0,256
Q3 = DMP2035U: PFET; Manufacturer: Diodes Incorporated; Vds: 20V; Vgss: 8V; Id: 3,6A; Temp_ Max: 150; Temp_ Min: -55; Part Number: DMP2035U; OrderingCode: DMP2035U-7; Supplier: Silica; Price (€): 0,08
Q5 = PMBT3906: PNP; Manufacturer: NXP; Vcbo: -40V; Vebo: -6V; Ic: 200mA; OrderingCode: PMBT3906,215; Temp_ Max: 150; Temp_ Min: -65; Part Number: PMBT3906; Vceo: -40V; Price (€): 0,019
R24 R25 R27 R28 R30 R33 R34 R37 R38 = R0402_10k_0.063W_±5%: as R1 on sheet [2]_FPGA; PackageDescription: SMD; Part Number: R0402_10k_0.063W_±5%; Price (€): 0,003
R26 R29 R36 = R0402_100k_0.063W_±5%: Resistor, SMD; Manufacturer: Vishay; Tolerance: ±5%; OrderingCode: CRCW0402100KJN; Power: 0.063W; Resistance: 100k; Temp_ Max: 155; Temp_ Min: -55; PackageDescription: SMD; Part Number: R0402_100k_0.063W_±5%; Price (€): 0,003
R35 = R0402_100R_0.063W_±5%: as R9 on sheet [2]_FPGA; PackageDescription: SMD; Part Number: R0402_100R_0.063W_±5%; Price (€): 0,003
R39 = R0402_2k2_0.063W_±5%: as R46 on sheet [2]_FPGA; PackageDescription: SMD; Part Number: R0402_2k2_0.063W_±5%; Price (€): 0,003
SW3 = Switch SPDT: Manufacturer: Würth Elektronik; OrderingCode: 450 302 014 072; Temp_ Max: 85; Temp_ Min: -40; OrderingCode 2: MMP1010D-RA; Part Number: Switch SPDT; Supplier: Würth; Price (€): 0,4144; Manufacturer 2: Knitter-Switch
SW4 = SW Vertical THT: Micro miniature pushbutton surface Switch; Manufacturer: C&K Components; OrderingCode: PTS645VL39-2 LFS; Temp_ Max: 60; Temp_ Min: -20; Part Number: SW Vertical THT; Price (€): 0,104; Supplier: Abacus
U10 = AP7361: LDO Regulator, 8 pin, adjustable and fixed mode with enable; Manufacturer: Diodes Inc.; Voltage IN: 2,2÷6 VDC; Voltage OUT: 3.3VDC; Current OUT: 1A; OrderingCode: AP7361-33FGE-7; Temp_ Max: 85; Temp_ Min: -40; Part Number: AP7361; Supplier: Silica; Price (€): 0,187
U11 = TLV711: LDO Regulator, Dual, 6 pin; Manufacturer: Texas Instruments; Voltage IN: 2÷5,5 VDC; Voltage OUT: 1,2 & 3,3 V; Current OUT: 200 & 200 mA; OrderingCode: TLV7111233DSER; Temp_ Max: 125; Temp_ Min: -40; Part Number: TLV711; Supplier: Silica; Price (€): 0,224
U12 = TPS62133: 3A High Efficient Synchronous Step Down Converter with DCS™ Control; Manufacturer: Texas Instruments; Voltage IN: 3÷17 VDC; Voltage OUT: 0,9÷6 VDC; Temp_ Max: 85; Temp_ Min: -40; Part Number: TPS62133; Current OUT: 3A; OrderingCode: TPS62133RGTR; Supplier: Silica; Price (€): 1,5
U13 = APX810: Voltage supervisor, Reset active high, 200ms; Part Number: APX810; Manufacturer: Diodes Incorporated; OrderingCode: APX810-29SAG-7; Temp_ Max: 105; Temp_ Min: -40; Value: 2,93V; Supplier: Silica; Price (€): 0,1